# EAGLE design IOTKit_ch_open_V2 (EAGLE 6.5.0)

## Sheet 1 of 2
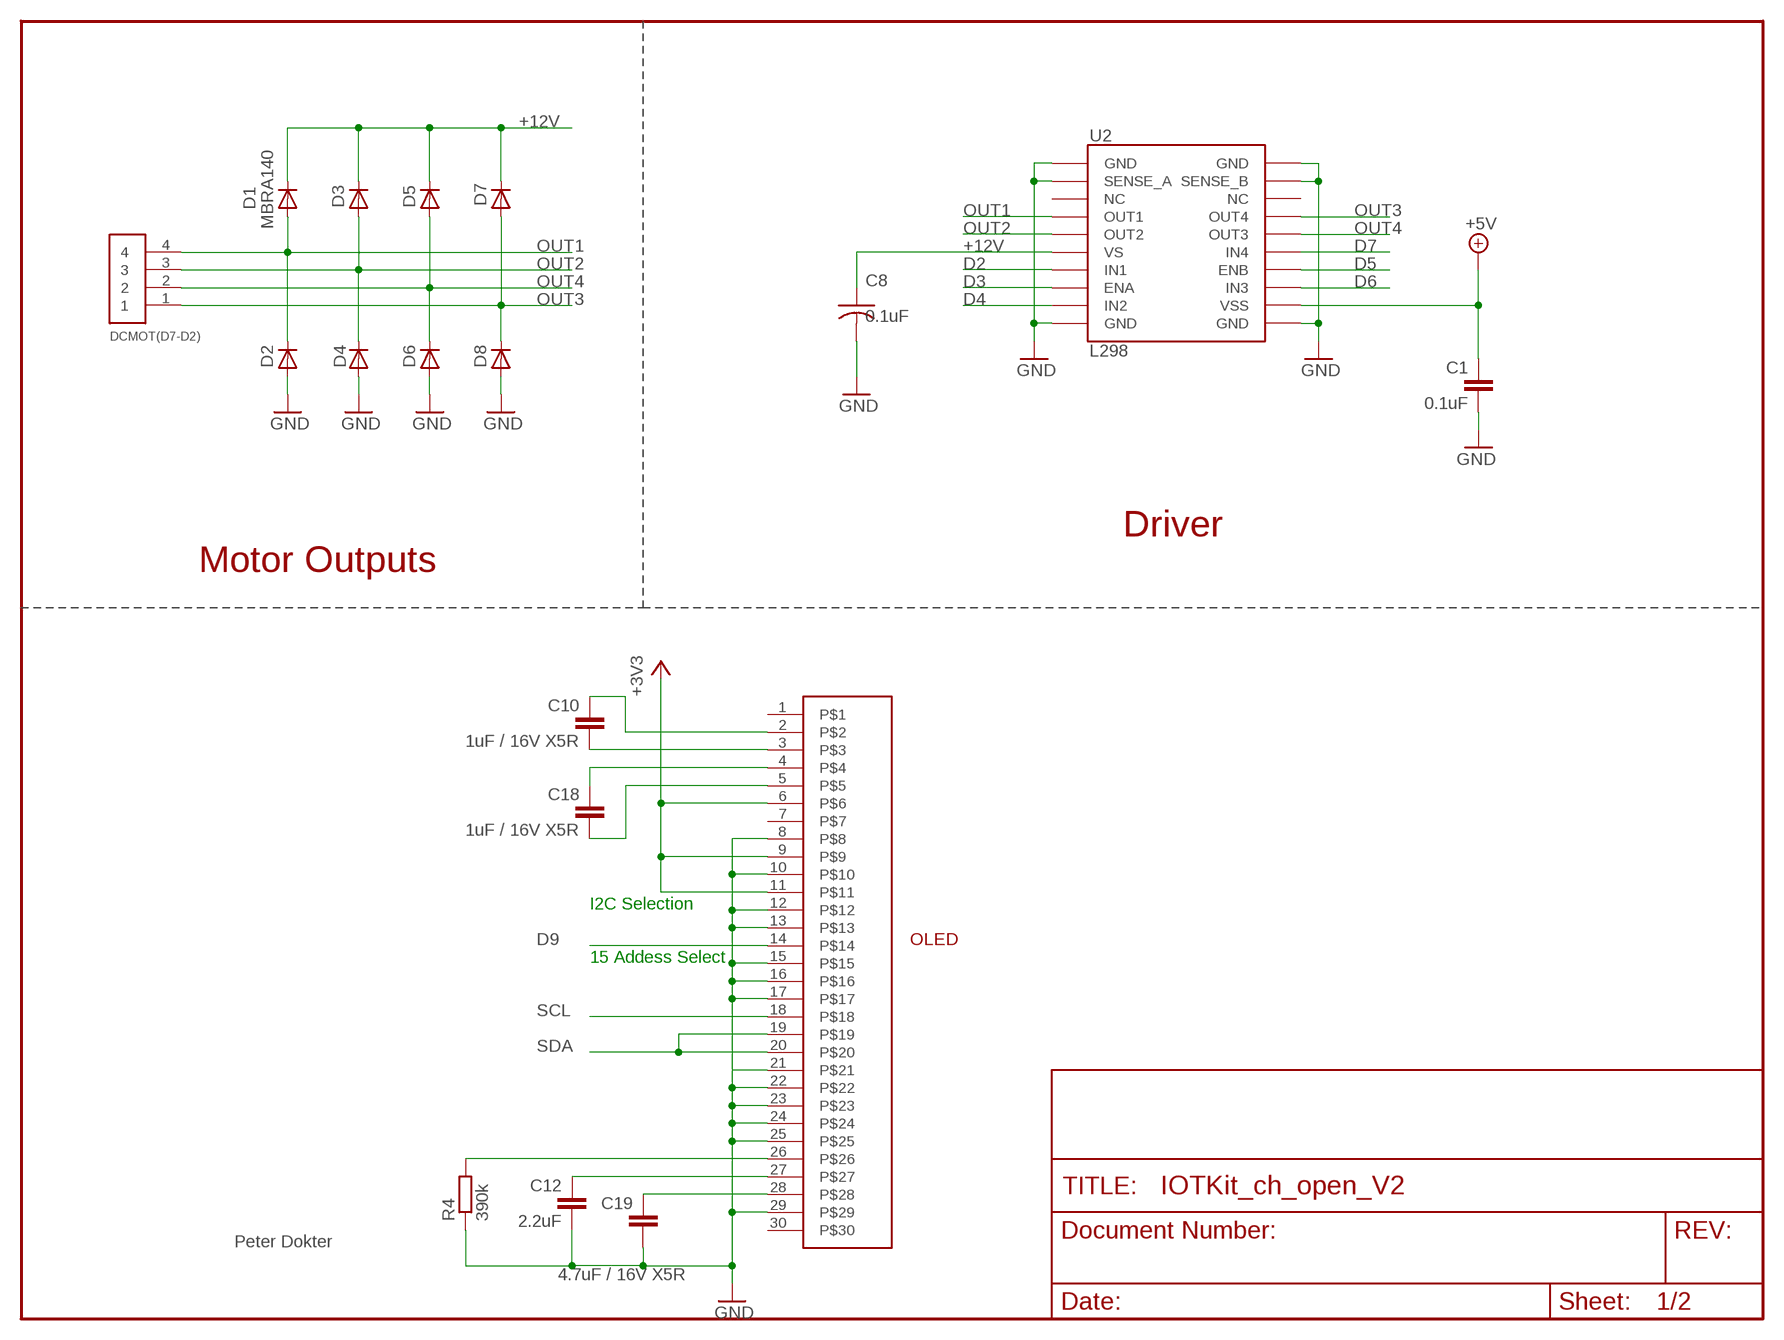
[diagram p0: schematic, sheet 1]

### Parts
C1  0.1uF  CAP0402-CAP  [0402-CAP]
C8  0.1uF  C-USC0603K  [C0603K]
C10  1uF / 16V X5R  CAP0603-CAP  [0603-CAP]
C12  2.2uF  CAP0603-CAP  [0603-CAP]
C18  1uF / 16V X5R  CAP0603-CAP  [0603-CAP]
C19  4.7uF / 16V X5R  CAP0603-CAP  [0603-CAP]
D1  MBRA140  DIODESMA  [SMA-DIODE]
D2  MBRA140  DIODESMA  [SMA-DIODE]
D3  MBRA140  DIODESMA  [SMA-DIODE]
D4  MBRA140  DIODESMA  [SMA-DIODE]
D5  MBRA140  DIODESMA  [SMA-DIODE]
D6  MBRA140  DIODESMA  [SMA-DIODE]
D7  MBRA140  DIODESMA  [SMA-DIODE]
D8  MBRA140  DIODESMA  [SMA-DIODE]
DCMOT(D7-D2)  1X4  [1X04_LINE]
R4  390k  R-EU_R0603  [R0603]
U2  L298  L298_BRIDGE_DRIVER  [POWERSO20]
U$4  OLED_096_1  [OLED_096_1]

### Nets
+3V3: U$4.6 U$4.9 U$4.11 ; also sheet 2
+5V: C1.1 U2.P$12(VSS) ; also sheet 2
+12V: C8.1 D1.C D3.C D5.C D7.C U2.P$6(VS) ; also sheet 2
D2: U2.P$7(IN1) ; also sheet 2
D3: U2.P$8(ENA) ; also sheet 2
D4: U2.P$9(IN2) ; also sheet 2
D5: U2.P$14(ENB) ; also sheet 2
D6: U2.P$13(IN3) ; also sheet 2
D7: U2.P$15(IN4) ; also sheet 2
D9: U$4.14 ; also sheet 2
GND: C1.2 C8.2 C12.2 C19.2 D2.A D4.A D6.A D8.A R4.1 U2.P$1(GND) U2.P$2(SENSE_A) U2.P$10(GND) U2.P$11(GND) U2.P$19(SENSE_B) U2.P$20(GND) U$4.8 U$4.10 U$4.12 U$4.13 U$4.15 U$4.16 U$4.17 U$4.21 U$4.22 U$4.23 U$4.24 U$4.25 U$4.29 ; also sheet 2
N$2: C18.2 U$4.5
N$15: R4.2 U$4.26
N$19: C19.1 U$4.28
N$30: C12.1 U$4.27
N$32: C18.1 U$4.4
N$47: C10.2 U$4.3
N$48: C10.1 U$4.2
OUT1: D1.A D2.C DCMOT(D7-D2).4 U2.P$4(OUT1)
OUT2: D3.A D4.C DCMOT(D7-D2).3 U2.P$5(OUT2)
OUT3: D7.A D8.C DCMOT(D7-D2).1 U2.P$17(OUT4)
OUT4: D5.A D6.C DCMOT(D7-D2).2 U2.P$16(OUT3)
SCL: U$4.18 ; also sheet 2
SDA: U$4.19 U$4.20 ; also sheet 2
Unconnected: U2.P$3(NC) U2.P$18(NC) U$4.1 U$4.7 U$4.30

### Notes on the sheet
- Driver
- Motor Outputs
- I2C Selection
- 15 Addess Select
- Peter Dokter

## Sheet 2 of 2
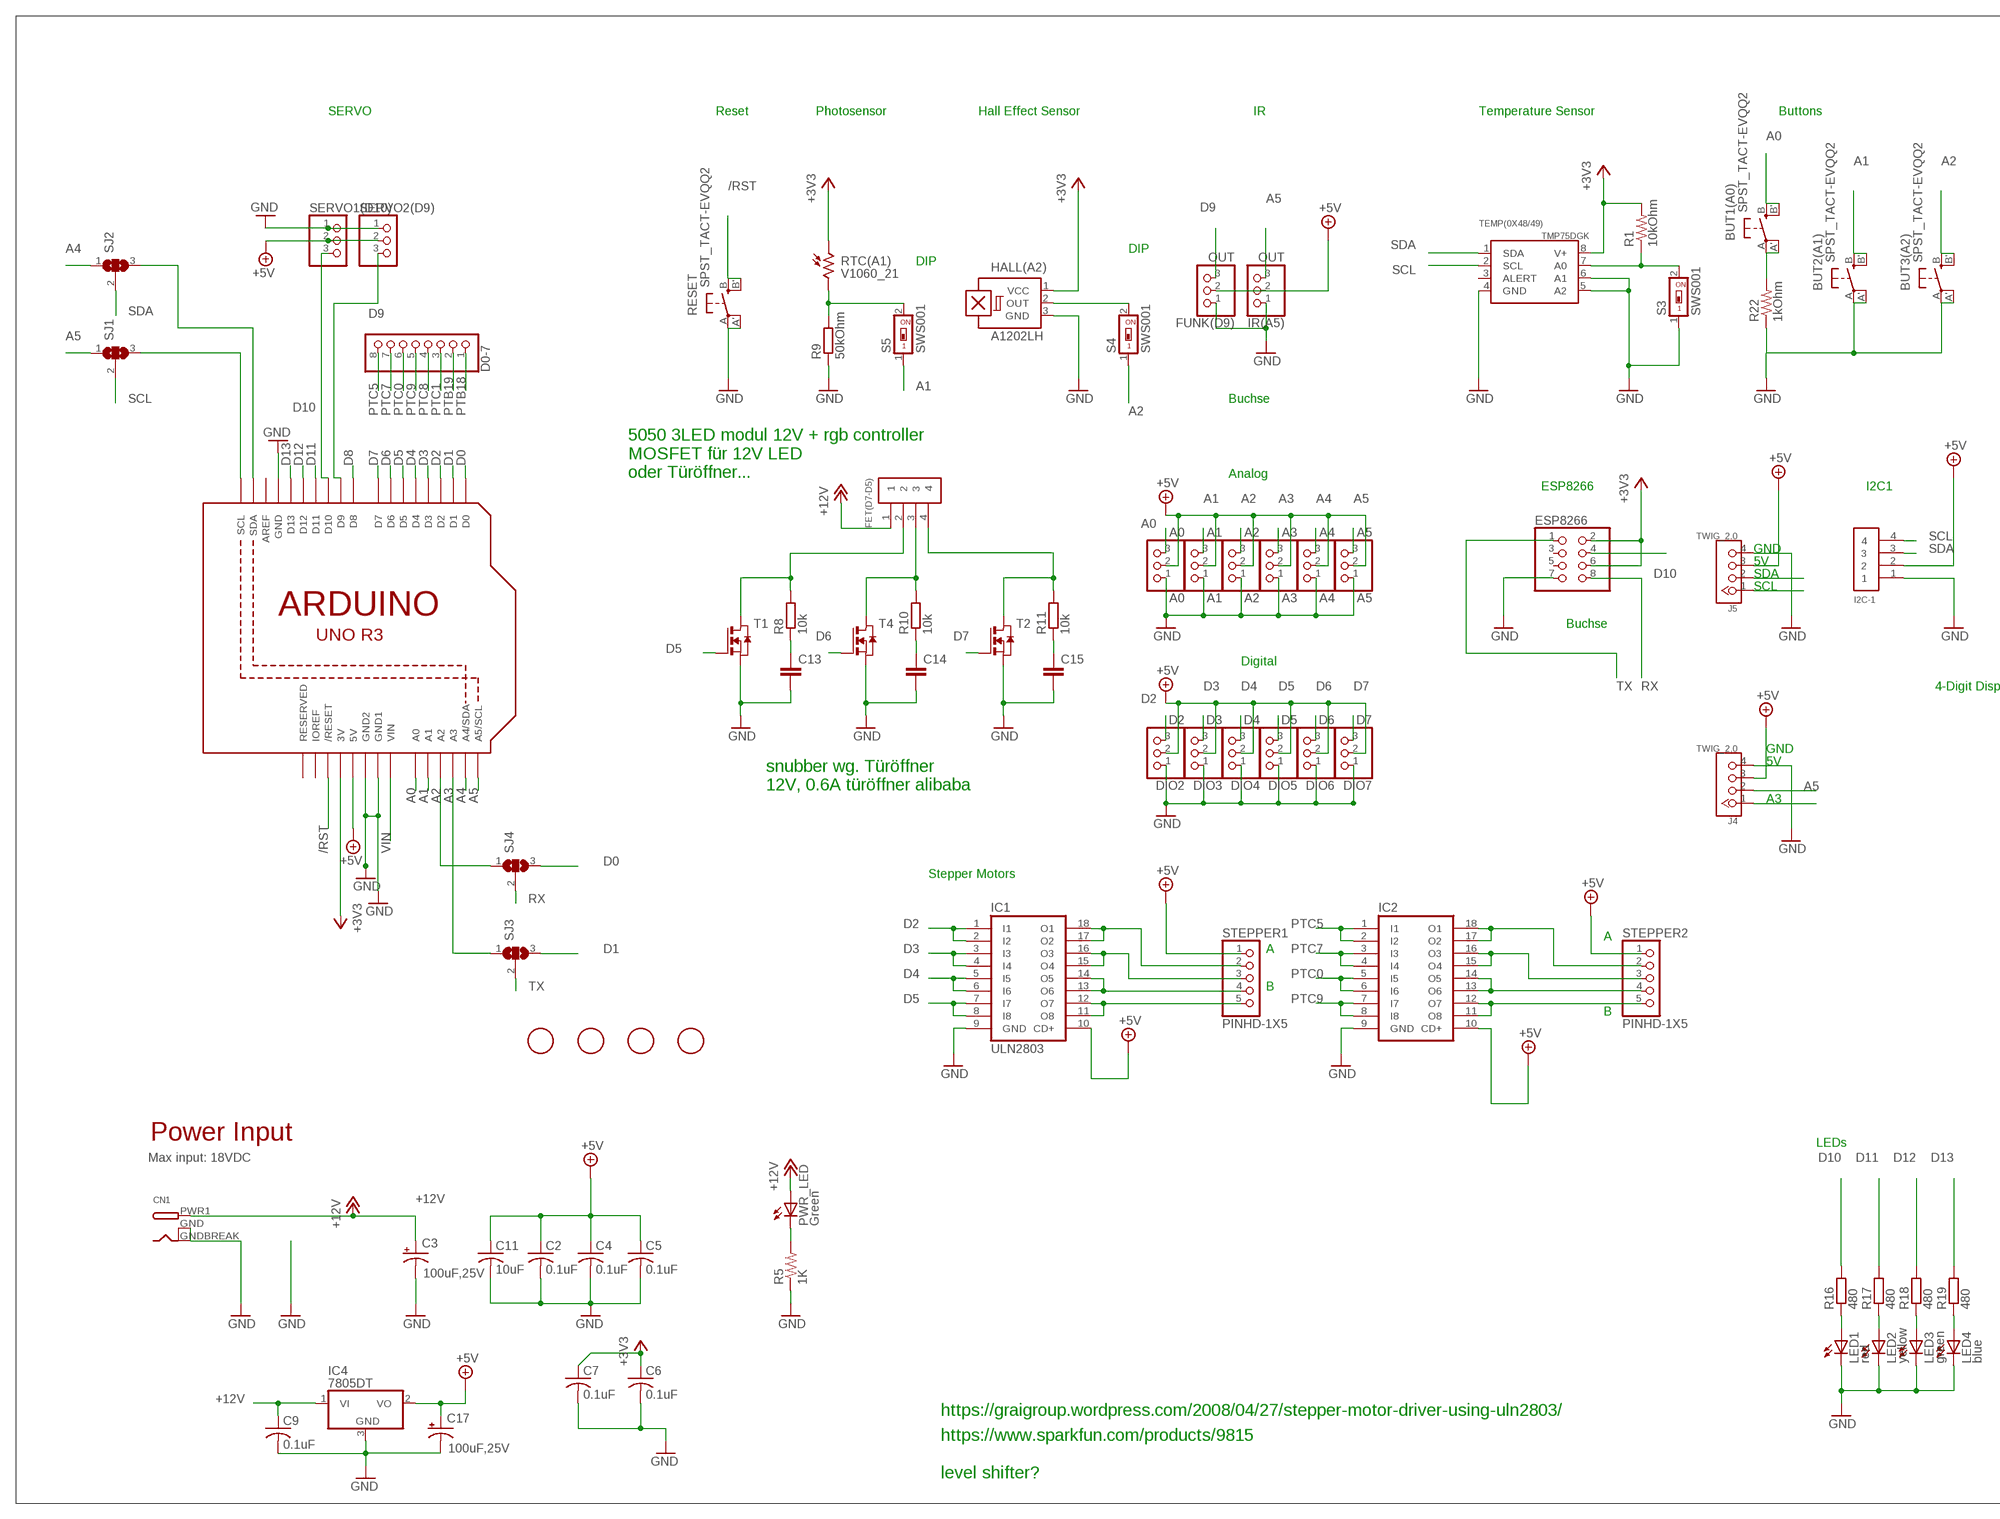
[diagram p1: schematic, sheet 2, part 1 of 2]
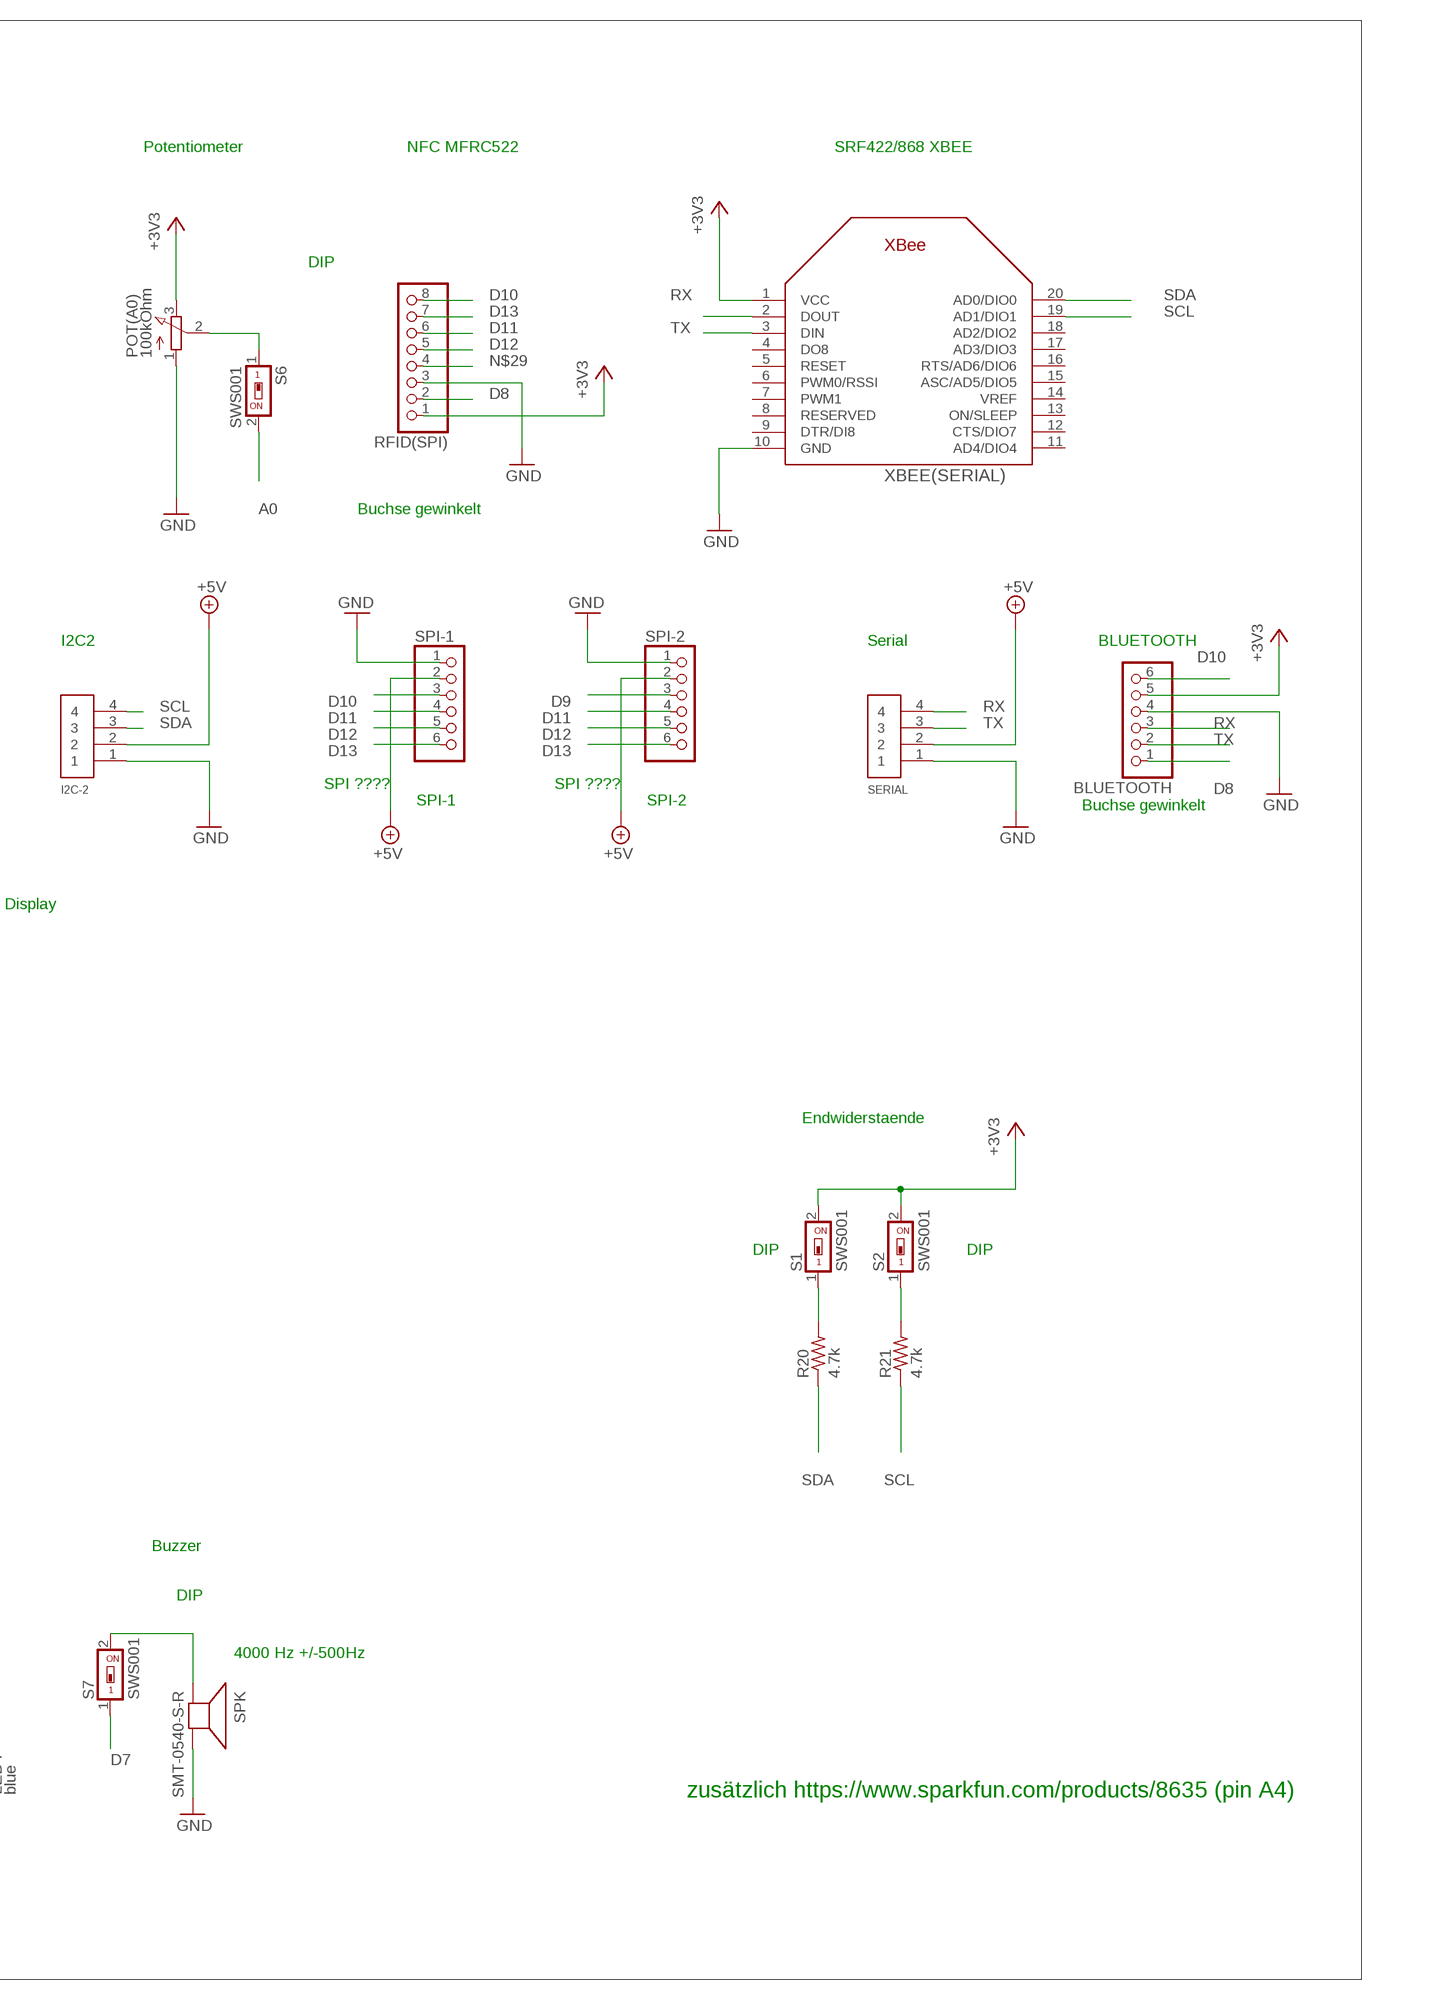
[diagram p2: schematic, sheet 2, part 2 of 2]

### Parts
A0  A0  PINHD-1X3  [1X03_LINE]
A1  A1  PINHD-1X3  [1X03_LINE]
A2  A2  PINHD-1X3  [1X03_LINE]
A3  A3  PINHD-1X3  [1X03_LINE]
A4  A4  PINHD-1X3  [1X03_LINE]
A5  A5  PINHD-1X3  [1X03_LINE]
BLUETOOTH  PINHD-1X6B  [1X06-BIG]
BUT1(A0)  SPST_TACT-EVQQ2  [EVQ-Q2]
BUT2(A1)  SPST_TACT-EVQQ2  [EVQ-Q2]
BUT3(A2)  SPST_TACT-EVQQ2  [EVQ-Q2]
C2  0.1uF  C-USC0603K  [C0603K]
C3  100uF,25V  CAP_POLF80  [NIPPON_F80]
C4  0.1uF  C-USC0603K  [C0603K]
C5  0.1uF  C-USC0603K  [C0603K]
C6  0.1uF  C-USC0603K  [C0603K]
C7  0.1uF  C-USC0603K  [C0603K]
C9  0.1uF  C-USC0805K  [C0805K]
C11  10uF  C-USC0805K  [C0805K]
C13  C-EUC0603  [C0603]
C14  C-EUC0603  [C0603]
C15  C-EUC0603  [C0603]
C17  100uF,25V  CAP_POLF80  [NIPPON_F80]
CN1  DCBARRELSMT  [DCJACK_2MM_SMT]
D0-7  PINHD-1X8CLEANBIG  [1X08-CLEANBIG]
DIO2  D2  PINHD-1X3  [1X03_LINE]
DIO3  D3  PINHD-1X3  [1X03_LINE]
DIO4  D4  PINHD-1X3  [1X03_LINE]
DIO5  D5  PINHD-1X3  [1X03_LINE]
DIO6  D6  PINHD-1X3  [1X03_LINE]
DIO7  D7  PINHD-1X3  [1X03_LINE]
ESP8266  PINHD-2X4  [2X04]
FET(D7-D5)  1X4  [1X04_LINE]
FUNK(D9)  OUT  PINHD-1X3  [1X03_LINE]
HALL(A2)  A1202LH  [SOT23-W]
I2C-1  1X4  [1X04_LINE]
I2C-2  1X4  [1X04_LINE]
IC1  ULN2803  ULN2803ASO18W  [SO18W]
IC2  ULN2803ASO18W  [SO18W]
IC4  7805DT  [TO252]
IR(A5)  OUT  PINHD-1X3  [1X03_LINE]
J4  TWIG_2.0  [2.0_1X4]
J5  TWIG_2.0  [2.0_1X4]
LED1  red  LEDCHIP-LED0603  [CHIP-LED0603]
LED2  yellow  LEDCHIP-LED0603  [CHIP-LED0603]
LED3  green  LEDCHIP-LED0603  [CHIP-LED0603]
LED4  blue  LEDCHIP-LED0603  [CHIP-LED0603]
POT(A0)  100kOhm  EVUF3A  [EVUF]
PWR_LED  Green  LEDCHIP-LED0805  [CHIP-LED0805]
R1  10kOhm  R-US_R0805  [R0805]
R5  1K  R-US_R0805  [R0805]
R8  10k  R-EU_R0805  [R0805]
R9  50kOhm  R-EU_R0603  [R0603]
R10  10k  R-EU_R0805  [R0805]
R11  10k  R-EU_R0805  [R0805]
R16  480  R-EU_R0603  [R0603]
R17  480  R-EU_R0603  [R0603]
R18  480  R-EU_R0603  [R0603]
R19  480  R-EU_R0603  [R0603]
R20  4.7k  R-US_R0805  [R0805]
R21  4.7k  R-US_R0805  [R0805]
R22  1kOhm  R-US_R0805  [R0805]
RESET  SPST_TACT-EVQQ2  [EVQ-Q2]
RFID(SPI)  PINHD-1X8BIG  [1X08-BIG]
RTC(A1)  V1060_21  [TO-5_V10]
S1  SWS001  [SMS-001]
S2  SWS001  [SMS-001]
S3  SWS001  [SMS-001]
S4  SWS001  [SMS-001]
S5  SWS001  [SMS-001]
S6  SWS001  [SMS-001]
S7  SWS001  [SMS-001]
SERIAL  1X4  [1X04_LINE]
SERVO1(D10)  PINHD-1X3  [1X03]
SERVO2(D9)  PINHD-1X3  [1X03]
SJ1  SJ2W  [SJ_2]
SJ2  SJ2W  [SJ_2]
SJ3  SJ2W  [SJ_2]
SJ4  SJ2W  [SJ_2]
SPI-1  PINHD-1X6B  [1X06-BIG]
SPI-2  PINHD-1X6B  [1X06-BIG]
SPK  SMT-0540-S-R  [SMT-0540-S-R]
STEPPER1  PINHD-1X5  [1X05]
STEPPER2  PINHD-1X5  [1X05]
T1  NMOSSOT223  [SOT223]
T2  NMOSSOT223  [SOT223]
T4  NMOSSOT223  [SOT223]
TEMP(0X48/49)  TMP75DGK  [MSOP8]
U$1  FIDUCIAL  [FIDUCIAL_1MM]
U$2  FIDUCIAL  [FIDUCIAL_1MM]
U$3  FIDUCIAL  [FIDUCIAL_1MM]
U$5  ARDUINOR3NONAME  [ARDUINOR2_ICSP_NODIM_NONAME]
U$6  FIDUCIAL  [FIDUCIAL_1MM]
XBEE(SERIAL)  XBEE  [XBEE]

### Nets
+3V3: BLUETOOTH.5 C6.1 C7.1 ESP8266.2 ESP8266.6 HALL(A2).1(VCC) POT(A0).3(E) R1.2 RFID(SPI).1 RTC(A1).1 S1.2 S2.2 TEMP(0X48/49).8(V+) U$5.3V XBEE(SERIAL).1(VCC) ; also sheet 1
+5V: A0.2 A1.2 A2.2 A3.2 A4.2 A5.2 C2.1 C4.1 C5.1 C11.1 C17.+ DIO2.2 DIO3.2 DIO4.2 DIO5.2 DIO6.2 DIO7.2 FUNK(D9).2 I2C-1.2 I2C-2.2 IC1.10(CD+) IC2.10(CD+) IC4.2(VO) IR(A5).2 J4.3 J5.3 SERIAL.2 SERVO1(D10).2 SERVO2(D9).2 SPI-1.2 SPI-2.2 STEPPER1.1 STEPPER2.1 U$5.5V ; also sheet 1
+12V: C3.+ C9.1 CN1.PWR1(PWR) FET(D7-D5).1 IC4.1(VI) PWR_LED.A ; also sheet 1
/RST: RESET.B'(S1) RESET.B(S) U$5.RESET(/RESET)
A0: A0.3 BUT1(A0).B'(S1) BUT1(A0).B(S) S6.2 U$5.A0
A1: A1.3 BUT2(A1).B'(S1) BUT2(A1).B(S) S5.1 U$5.A1
A2: A2.3 BUT3(A2).B'(S1) BUT3(A2).B(S) S4.1 SJ4.1 U$5.A2
A3: A3.3 J4.1 SJ3.1 U$5.A3
A4: A4.3 SJ2.1 U$5.A4(A4/SDA)
A5: A5.3 IR(A5).3 J4.2 SJ1.1 U$5.A5(A5/SCL)
D0: SJ4.3 U$5.D0
D1: SJ3.3 U$5.D1
D2: DIO2.3 IC1.1(I1) IC1.2(I2) U$5.D2 ; also sheet 1
D3: DIO3.3 IC1.3(I3) IC1.4(I4) U$5.D3 ; also sheet 1
D4: DIO4.3 IC1.5(I5) IC1.6(I6) U$5.D4 ; also sheet 1
D5: DIO5.3 IC1.7(I7) IC1.8(I8) T1.1(G) U$5.D5 ; also sheet 1
D6: DIO6.3 T4.1(G) U$5.D6 ; also sheet 1
D7: DIO7.3 S7.1 T2.1(G) U$5.D7 ; also sheet 1
D8: BLUETOOTH.1 RFID(SPI).2 U$5.D8
D9: FUNK(D9).3 SERVO2(D9).3 SPI-2.3 U$5.D9 ; also sheet 1
D10: BLUETOOTH.6 ESP8266.4 R16.2 RFID(SPI).8 SERVO1(D10).3 SPI-1.3 U$5.D10
D11: R17.2 RFID(SPI).6 SPI-1.4 SPI-2.4 U$5.D11
D12: R18.2 RFID(SPI).5 SPI-1.5 SPI-2.5 U$5.D12
D13: R19.2 RFID(SPI).7 SPI-1.6 SPI-2.6 U$5.D13
GND: A0.1 A1.1 A2.1 A3.1 A4.1 A5.1 BLUETOOTH.4 BUT2(A1).A'(P1) BUT2(A1).A(P) BUT3(A2).A'(P1) BUT3(A2).A(P) C2.2 C3.- C4.2 C5.2 C6.2 C7.2 C9.2 C11.2 C13.2 C14.2 C15.2 C17.- CN1.GND(GNDBREAK) CN1.GNDBREAK(GND) DIO2.1 DIO3.1 DIO4.1 DIO5.1 DIO6.1 DIO7.1 ESP8266.7 FUNK(D9).1 HALL(A2).3(GND) I2C-1.1 I2C-2.1 IC1.9(GND) IC2.9(GND) IC4.3(GND) IR(A5).1 J4.4 J5.4 LED1.C LED2.C LED3.C LED4.C POT(A0).1(A) R5.1 R9.1 R22.1 RESET.A'(P1) RESET.A(P) RFID(SPI).3 S3.1 SERIAL.1 SERVO1(D10).1 SERVO2(D9).1 SPI-1.1 SPI-2.1 SPK.+(-) T1.3(S) T2.3(S) T4.3(S) TEMP(0X48/49).4(GND) TEMP(0X48/49).5(A2) TEMP(0X48/49).6(A1) U$5.GND U$5.GND@1(GND1) U$5.GND@2(GND2) XBEE(SERIAL).10(GND) ; also sheet 1
N$1: R20.2 S1.1
N$3: R9.2 RTC(A1).2 S5.2
N$4: HALL(A2).2(OUT) S4.2
N$5: R21.2 S2.1
N$7: POT(A0).2(S) S6.1
N$8: S7.2 SPK.-(+)
N$9: R1.1 S3.2 TEMP(0X48/49).7(A0)
N$10: SJ1.3 U$5.SCL
N$11: SJ2.3 U$5.SDA
N$20: LED1.A R16.1
N$21: LED2.A R17.1
N$22: LED3.A R18.1
N$23: LED4.A R19.1
N$24: IC2.11(O8) IC2.12(O7) STEPPER2.5
N$25: IC2.13(O6) IC2.14(O5) STEPPER2.4
N$26: IC2.15(O4) IC2.16(O3) STEPPER2.3
N$27: IC2.17(O2) IC2.18(O1) STEPPER2.2
N$29: RFID(SPI).4
N$31: BUT1(A0).A'(P1) BUT1(A0).A(P) R22.2
N$34: C13.1 R8.1
N$35: FET(D7-D5).2 R8.2 T1.2(D) T1.4(D)
N$36: C14.1 R10.1
N$37: FET(D7-D5).3 R10.2 T4.2(D) T4.4(D)
N$38: C15.1 R11.1
N$39: FET(D7-D5).4 R11.2 T2.2(D) T2.4(D)
N$41: IC1.11(O8) IC1.12(O7) STEPPER1.5
N$42: IC1.13(O6) IC1.14(O5) STEPPER1.4
N$43: IC1.15(O4) IC1.16(O3) STEPPER1.3
N$44: IC1.17(O2) IC1.18(O1) STEPPER1.2
PTB18: D0-7.1
PTB19: D0-7.2
PTC0: D0-7.6 IC2.5(I5) IC2.6(I6)
PTC1: D0-7.3
PTC5: D0-7.8 IC2.1(I1) IC2.2(I2)
PTC7: D0-7.7 IC2.3(I3) IC2.4(I4)
PTC8: D0-7.4
PTC9: D0-7.5 IC2.7(I7) IC2.8(I8)
PWR_LED: PWR_LED.C R5.2
RX: BLUETOOTH.3 ESP8266.8 SERIAL.4 SJ4.2 XBEE(SERIAL).2(DOUT)
SCL: I2C-1.4 I2C-2.4 J5.1 R21.1 SJ1.2 TEMP(0X48/49).2(SCL) XBEE(SERIAL).19(AD1/DIO1) ; also sheet 1
SDA: I2C-1.3 I2C-2.3 J5.2 R20.1 SJ2.2 TEMP(0X48/49).1(SDA) XBEE(SERIAL).20(AD0/DIO0) ; also sheet 1
TX: BLUETOOTH.2 ESP8266.1 SERIAL.3 SJ3.2 XBEE(SERIAL).3(DIN)
VIN: U$5.VIN
Unconnected: ESP8266.3 ESP8266.5 TEMP(0X48/49).3(ALERT) U$5.AREF U$5.IOREF U$5.RESERVED XBEE(SERIAL).4(DO8) XBEE(SERIAL).5(RESET) XBEE(SERIAL).6(PWM0/RSSI) XBEE(SERIAL).7(PWM1) XBEE(SERIAL).8(RESERVED) XBEE(SERIAL).9(DTR/DI8) XBEE(SERIAL).11(AD4/DIO4) XBEE(SERIAL).12(CTS/DIO7) XBEE(SERIAL).13(ON/SLEEP) XBEE(SERIAL).14(VREF) XBEE(SERIAL).15(ASC/AD5/DIO5) XBEE(SERIAL).16(RTS/AD6/DIO6) XBEE(SERIAL).17(AD3/DIO3) XBEE(SERIAL).18(AD2/DIO2)

### Notes on the sheet
- SERVO | Reset | Photosensor | Hall Effect Sensor | IR | Temperature Sensor | Buttons | Potentiometer | NFC MFRC522 | SRF422/868 XBEE
- DIP
- DIP
- DIP
- Buchse gewinkelt
- Buchse
- 5050 3LED modul 12V + rgb controller
- MOSFET für 12V LED
  oder Türöffner...
- Analog
- ESP8266 | I2C1 | I2C2 | Serial | BLUETOOTH
- GND
- 5V
- SDA
- SCL | SPI ???? | SPI ????
- SPI-1 | SPI-2
- Buchse gewinkelt
- Buchse
- Digital
- 4-Digit Display
- GND
- 5V
- snubber wg. Türöffner
  12V, 0.6A türöffner alibaba
- A3
- Endwiderstaende
- Stepper Motors
- A
- A | DIP | DIP
- B
- B
- Power Input
- LEDs
- Max input: 18VDC
- Buzzer
- DIP
- 4000 Hz +/-500Hz
- zusätzlich https://www.sparkfun.com/products/8635 (pin A4)
- https://graigroup.wordpress.com/2008/04/27/stepper-motor-driver-using-uln2803/
- https://www.sparkfun.com/products/9815
- level shifter?

## Library data of the parts
A0 A1-A5 DIO2-DIO7 FUNK(D9) IR(A5) = Gaudi:PINHD-1X3: PIN HEADER
BLUETOOTH SPI-1 SPI-2 = adafruit:PINHD-1X6: PIN HEADER
BUT1(A0) BUT2(A1) BUT3(A2) RESET = adafruit:SPST_TACT: SMT 6mm switch, EVQQ2 series http://www.ladyada.net/library/eagle
C1 C10 C12 C18 C19 = SparkFun:CAP: Capacitor Standard 0603 ceramic capacitor, and 0.1" leaded capacitor.
C2 C4-C9 C11 = adafruit:C-US: CAPACITOR, American symbol
C3 C17 = SparkFun:CAP_POL: Capacitor Polarized These are standard SMD and PTH capacitors. Normally 10uF, 47uF, and 100uF in electrolytic and tantalum varieties. Always verify the external diameter of the through hole cap, it varies with capacity, voltage, and manufacturer. The EIA devices should be standard.
C13-C15 = resistor:C-EU: CAPACITOR, European symbol
CN1 = adafruit:DCBARREL: 2.0mm DC Barrel Jack DCJACK_2MM_PTH - Through Hole Jack (4UConnector: 05537)
D0-7 RFID(SPI) = adafruit:PINHD-1X8: PIN HEADER
D1-D8 = SparkFun:DIODE: Diode These are standard reverse protection diodes and small signal diodes. SMA package can handle up to about 1A. SOD-323 can handle about 200mA. What the SOD-323 package when ordering, there are some mfgs out there that are 5-pin packages.
DCMOT(D7-D2) FET(D7-D5) I2C-1 I2C-2 SERIAL = Gaudi:1X4: 4-pin connector
ESP8266 = adafruit:PINHD-2X4: PIN HEADER
HALL(A2) = allegro:A12*?: Hall-effect bipolar switch Source: http://www.allegromicro.com/en/Products/Part_Numbers/1202/1202.pdf; OC_FARNELL: unknown; OC_NEWARK: unknown
IC1 IC2 = IOTKit:ULN2803A: DRIVER ARRAY
IC4 = adafruit:78*: Positive VOLTAGE REGULATOR Added bigger pads to the TO-92 package
J4 J5 = CONNECTER:TWIG_2.0
LED1-LED4 PWR_LED = adafruit:LED: LED OSRAM: - CHIPLED LG R971, LG N971, LY N971, LG Q971, LY Q971, LO R971, LY R971 LH N974, LH R974 LS Q976, LO Q976, LY Q976 LO Q996 - Hyper CHIPLED LW Q18S LB Q993, LB Q99A, LB R99A - SideLED LS A670, LO A670, LY A670, LG A670, LP A670 LB A673, LV A673, LT A673, LW A673 LH A674 LY A675 LS A676, LA A676, LO A676, LY A676, LW A676 LS A679, LY A679, LG A679 - Hyper Micro SIDELED® LS Y876, LA Y876, LO Y876, LY Y876 LT Y87S - SmartLED LW L88C, LW L88S LB L89C, LB L89S, LG L890 LS L89K, LO L89K, LY L89K LS L896, LA L896, LO L896, LY L896 - TOPLED LS T670, LO T670, LY T670, LG T670, LP T670 LSG T670, LSP T670, LSY T670, LOP T670, LYG T670 LG T671, LOG T671, LSG T671 LB T673, LV T673, LT T673, LW T673 LH T674 LS T676, LA T676, LO T676, LY T676, LB T676, LH T676, LSB T676, LW T676 LB T67C, LV T67C, LT T67C, LS T67K, LO T67K, LY T67K, LW E67C LS E67B, LA E67B, LO E67B, LY E67B, LB E67C, LV E67C, LT E67C LW T67C LS T679, LY T679, LG T679 LS T770, LO T770, LY T770, LG T770, LP T770 LB T773, LV T773, LT T773, LW T773 LH T774 LS E675, LA E675, LY E675, LS T675 LS T776, LA T776, LO T776, LY T776, LB T776 LHGB T686 LT T68C, LB T68C - Hyper Mini TOPLED® LB M676 - Mini TOPLED Santana® LG M470 LS M47K, LO M47K, LY M47K Source: http://www.osram.convergy.de/
POT(A0) = Gaudi:EVU: 9 mm Square Rotary Potentiometers Source: Panasonic
R1 R5 R20-R22 = adafruit:R-US_: RESISTOR, American symbol
R4 R8-R11 R16-R19 = rcl:R-EU_: RESISTOR, European symbol
RTC(A1) = photo-elements:?1060*: Sensor Street Light control Source: http://optoelectronics.perkinelmer.com/content/Datasheets/DTS_PhotocellsB1060.pdf
S1-S7 = smd-special:SWS001: SMD Dip Switch 1 pol.
SERVO1(D10) SERVO2(D9) = adafruit:PINHD-1X3: PIN HEADER
SJ1-SJ4 = jumper:SJ2W: SMD solder JUMPER
SPK = adafruit:SMT-0540-S-R: SMT-0549-S-R Small surface-mount magnetic buzzer
STEPPER1 STEPPER2 = Gaudi:PINHD-1X5
T1 T2 T4 = zetex:NMOSSOT223: MOS FET; OC_FARNELL: unknown; OC_NEWARK: unknown
TEMP(0X48/49) = ti_tmp:TMP75
U2 = SparkFun:L298_BRIDGE_DRIVER
U$1-U$3 U$6 = adafruit:FIDUCIAL: For use by pick and place machines to calibrate the vision/machine, 1mm By microbuilder.eu
U$4 = Gaudi:OLED_096_1
U$5 = adafruit:ARDUINOR3: This is a new object for the new Arduino R3 - with extra pins that you may want to use (such as IOref, and duplicated A4/A5
XBEE(SERIAL) = adafruit:XBEE

## Net classes
1 power: width 0.61 mm

## Board
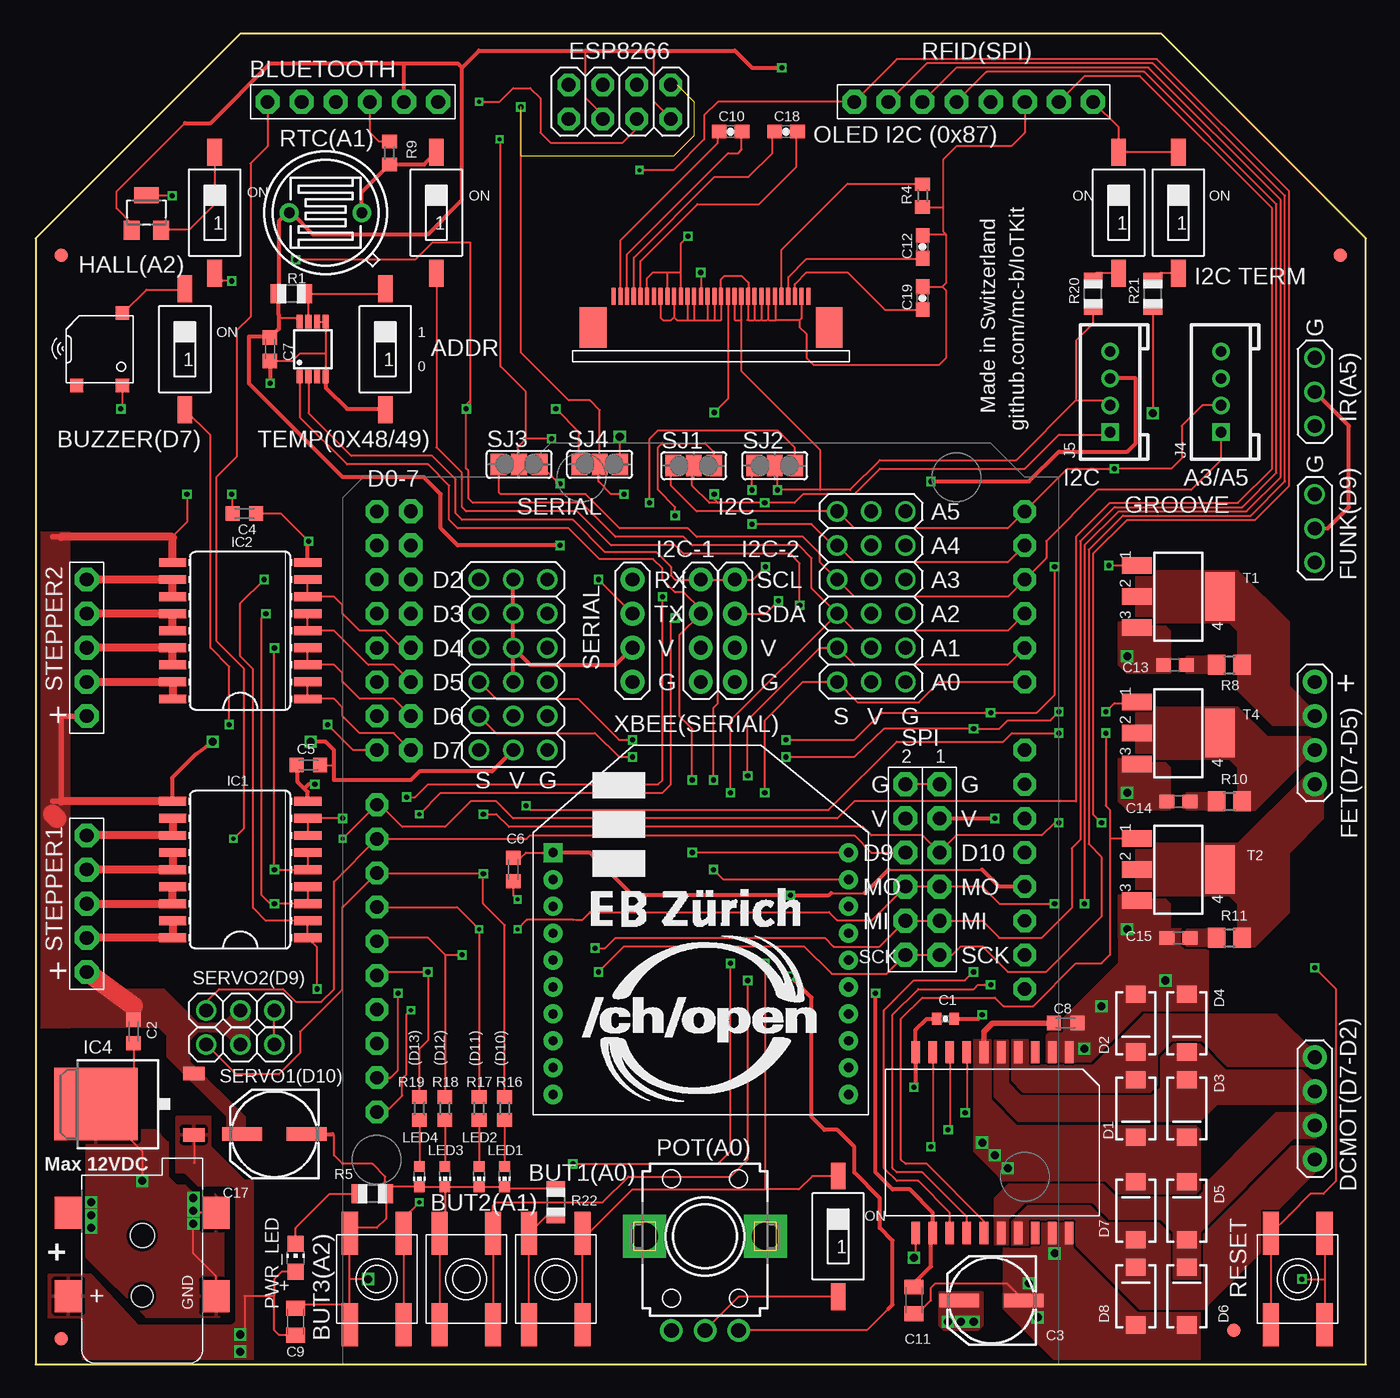
[diagram p3: board, top side]
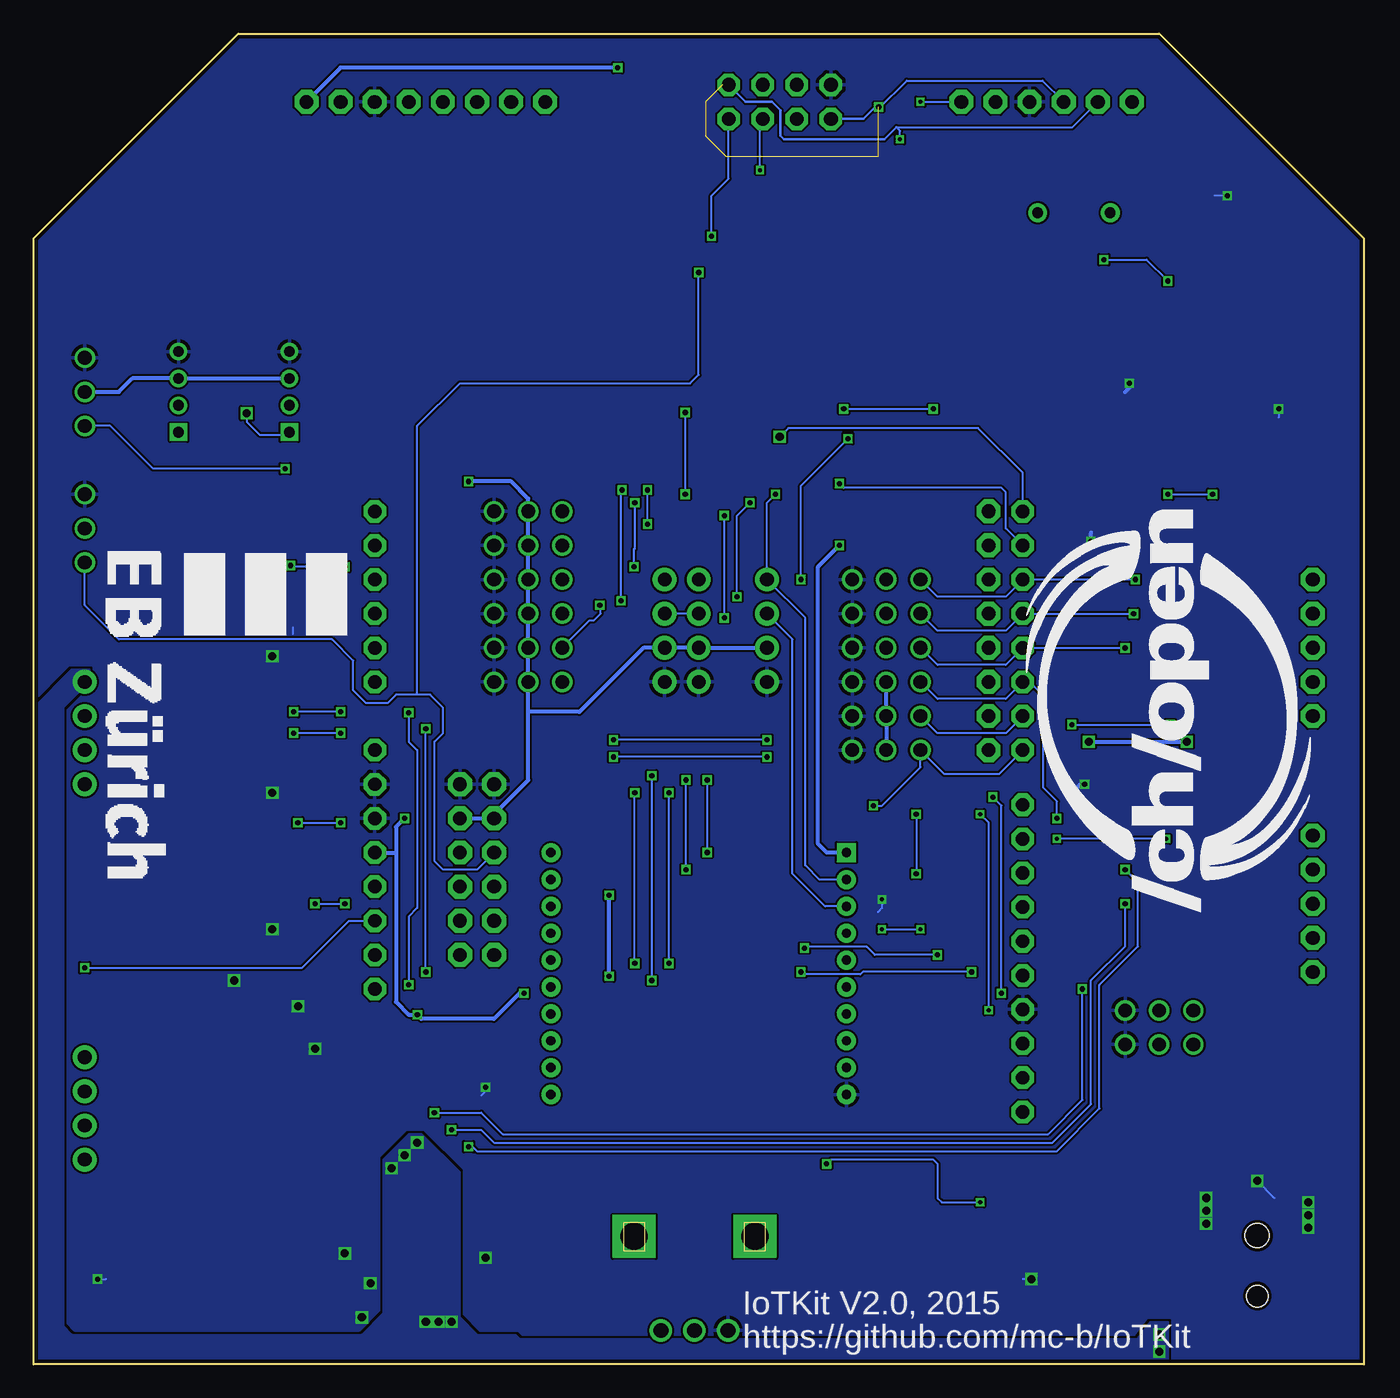
[diagram p4: board, bottom side, seen from below]

Size 99.06 x 99.06 mm. Coordinates in mm from the lower left corner, seen from the top.
Outline: 0,0 99.06,0 99.06,83.82 83.82,99.06 15.24,99.06 0,83.82 0,0
Copper layers (1*16): Top 0.035mm / dielectric 1.5mm / Bottom 0.035mm
Design rules "SeeedStudio_2layer_DRU_no_angle_20140221": minimum track width 6mil, minimum drill 12mil, track to track 6mil, track to pad 6mil, pad to pad 6mil, via to via 6mil, smd to smd 0mil, copper to edge 10mil, drill to drill 10mil, minimum pad ring 10mil, minimum via ring 6mil, stop-mask expansion 2mil, vias tented up to drill 100mil, thermal gap 10mil

### Footprints (pad centres in the part's own frame; a part is rotated, then mirrored left to right if it is on the bottom)
1X03_LINE = drill 1.016: 1 -2.54,0; 2 0,0; 3 2.54,0
1X06-BIG = drill 1.016 pad 1.778 octagon: 1 -6.35,0; 2 -3.81,0; 3 -1.27,0; 4 1.27,0; 5 3.81,0; 6 6.35,0
EVQ-Q2 = smd 3.2 x 1.2: A -3.4,-2; A' 3.4,-2; B -3.4,2; B' 3.4,2
0402-CAP = smd 0.7 x 0.9: 1 -0.65,0; 2 0.65,0
C0603K = smd 1.05 x 1.08: 1 -0.875,0; 2 0.875,0
NIPPON_F80 = smd 2.95 x 1: + 2.4,0; - -2.4,0
C0805K = smd 1.1 x 1.4: 1 -1,0; 2 1,0
0603-CAP = smd 1.1 x 1: 1 -0.85,0; 2 0.85,0
C0603 = smd 1.1 x 1: 1 -0.85,0; 2 0.85,0
DCJACK_2MM_SMT = smd 2.4 x 2: GND 0,-5.5; GNDBREAK 6.2,-5.5; PWR1 0,5.5; PWR2 6.2,5.5 | hole 1.6: 0,0 | hole 1.8: 4.5,0
1X08-CLEANBIG = drill 1.016 pad 1.778 octagon: 1 -8.89,0; 2 -6.35,0; 3 -3.81,0; 4 -1.27,0; 5 1.27,0; 6 3.81,0; 7 6.35,0; 8 8.89,0
SMA-DIODE = smd 1.27 x 1.47: A -2.15,0; C 2.15,0
1X04_LINE = drill 1.016 pad 1.778: 1 -3.81,0; 2 -1.27,0; 3 1.27,0; 4 3.81,0
2X04 = drill 1.016 pad 1.676 octagon: 1 -3.81,-1.27; 2 -3.81,1.27; 3 -1.27,-1.27; 4 -1.27,1.27; 5 1.27,-1.27; 6 1.27,1.27; 7 3.81,-1.27; 8 3.81,1.27
SOT23-W = smd 1.2 x 1.4: 1 -1.1,-1.3; 2 1.1,-1.3 | smd 1.8 x 1.2: 3 0,1.3
SO18W = smd 0.66 x 2.032: 1 -5.08,-5.029; 2 -3.81,-5.029; 3 -2.54,-5.029; 4 -1.27,-5.029; 5 0,-5.029; 6 1.27,-5.029; 7 2.54,-5.029; 8 3.81,-5.029; 9 5.08,-5.029; 10 5.08,5.029; 11 3.81,5.029; 12 2.54,5.029; 13 1.27,5.029; 14 0,5.029; 15 -1.27,5.029; 16 -2.54,5.029; 17 -3.81,5.029; 18 -5.08,5.029
TO252 = smd 1 x 1.6: 1 -2.28,-4.8; 2 2.28,-4.8 | smd 5.4 x 6.2: 3 0,2.5
2.0_1X4 = drill 0.8 pad 1.27 square: 1 -3,0 | drill 0.8 pad 1.27: 2 -1,0; 3 1,0; 4 3,0
CHIP-LED0603 = smd 0.8 x 0.8: A 0,-0.75; C 0,0.75
EVUF = drill 1.1 pad 1.676: 1 -2.5,-7; 2 0,-7; 3 2.5,-7 | drill 2 pad 3.2 square: M1 4.5,0; M2 -4.5,0
CHIP-LED0805 = smd 1.2 x 1.2: A 0,-1.05; C 0,1.05
R0805 = smd 1.1 x 1.4: 1 -1,0; 2 1,0
R0603 = smd 1 x 1.1: 1 -0.85,0; 2 0.85,0
R0805' = smd 1.3 x 1.5: 1 -0.95,0; 2 0.95,0
1X08-BIG = drill 1.016 pad 1.778 octagon: 1 -8.89,0; 2 -6.35,0; 3 -3.81,0; 4 -1.27,0; 5 1.27,0; 6 3.81,0; 7 6.35,0; 8 8.89,0
TO-5_V10 = drill 0.8 pad 1.4: 1 -2.7,0; 2 2.7,0
SMS-001 = smd 1.092 x 2.007: 1 0,-4.496; 2 0,4.496
1X03 = drill 1.016: 1 -2.54,0; 2 0,0; 3 2.54,0
SJ_2 = smd 1.168 x 1.6: 1 -1.524,0; 2 0,0; 3 1.524,0
SMT-0540-S-R = smd 1 x 1: + 1.7,-2.7; - 1.7,2.7; M -1.7,-2.7
1X05 = drill 1.016 pad 1.778 octagon: 1 -5.08,0; 2 -2.54,0; 3 0,0; 4 2.54,0; 5 5.08,0
SOT223 = smd 1.219 x 2.235: 1 -2.311,-3.099; 2 0,-3.099; 3 2.311,-3.099 | smd 3.6 x 2.2: 4 0,3.099
MSOP8 = smd 0.45 x 1: 1 -0.975,-2.05; 2 -0.325,-2.05; 3 0.325,-2.05; 4 0.975,-2.05; 5 0.975,2.05; 6 0.325,2.05; 7 -0.325,2.05; 8 -0.975,2.05
POWERSO20 = smd 1.651 x 0.635: P$1 -6.731,5.715; P$2 -6.731,4.445; P$3 -6.731,3.175; P$4 -6.731,1.905; P$5 -6.731,0.635; P$6 -6.731,-0.635; P$7 -6.731,-1.905; P$8 -6.731,-3.175; P$9 -6.731,-4.445; P$10 -6.731,-5.715; P$11 6.731,-5.715; P$12 6.731,-4.445; P$13 6.731,-3.175; P$14 6.731,-1.905; P$15 6.731,-0.635; P$16 6.731,0.635; P$17 6.731,1.905; P$18 6.731,3.175; P$19 6.731,4.445; P$20 6.731,5.715
FIDUCIAL_1MM = smd 1 x 1: 1 0,0
OLED_096_1 = smd 0.3 x 1.25: 1 -7.25,0; 2 -6.75,0; 3 -6.25,0; 4 -5.75,0; 5 -5.25,0; 6 -4.75,0; 7 -4.25,0; 8 -3.75,0; 9 -3.25,0; 10 -2.75,0; 11 -2.25,0; 12 -1.75,0; 13 -1.25,0; 14 -0.75,0; 15 -0.25,0; 16 0.25,0; 17 0.75,0; 18 1.25,0; 19 1.75,0; 20 2.25,0; 21 2.75,0; 22 3.25,0; 23 3.75,0; 24 4.25,0; 25 4.75,0; 26 5.25,0; 27 5.75,0; 28 6.25,0; 29 6.75,0; 30 7.25,0 | smd 2 x 3: P$31 8.803,-2.325; P$32 -8.796,-2.325
ARDUINOR2_ICSP_NODIM_NONAME = drill 1 pad 1.676 octagon: 3V 35.56,2.54; 5V 38.1,2.54; A0 50.8,2.54; A1 53.34,2.54; A2 55.88,2.54; A3 58.42,2.54; A4 60.96,2.54; A5 63.5,2.54; AREF 23.876,50.8; D0 63.5,50.8; D1 60.96,50.8; D2 58.42,50.8; D3 55.88,50.8; D4 53.34,50.8; D5 50.8,50.8; D6 48.26,50.8; D7 45.72,50.8; D8 41.656,50.8; D9 39.116,50.8; D10 36.576,50.8; D11 34.036,50.8; D12 31.496,50.8; D13 28.956,50.8; GND 26.416,50.8; GND@1 43.18,2.54; GND@2 40.64,2.54; IOREF 30.48,2.54; RESERVED 27.94,2.54; RESET 33.02,2.54; SCL 18.796,50.8; SDA 21.336,50.8; VIN 45.72,2.54
XBEE = drill 0.7 pad 1.422 square: 1 -11,5.5 | drill 0.7 pad 1.422: 2 -11,3.5; 3 -11,1.5; 4 -11,-0.5; 5 -11,-2.5; 6 -11,-4.5; 7 -11,-6.5; 8 -11,-8.5; 9 -11,-10.5; 10 -11,-12.5; 11 11,-12.5; 12 11,-10.5; 13 11,-8.5; 14 11,-6.5; 15 11,-4.5; 16 11,-2.5; 17 11,-0.5; 18 11,1.5; 19 11,3.5; 20 11,5.5

### Placement (x,y rotation side)
A0  62.23,50.8 180 top
A1  62.23,53.34 180 top
A2  62.23,55.88 180 top
A3  62.23,58.42 180 top
A4  62.23,60.96 180 top
A5  62.23,63.5 180 top
BLUETOOTH  23.62,93.98 0 top
BUT1(A0)  38.73,6.35 270 top
BUT2(A1)  32.07,6.35 270 top
BUT3(A2)  25.4,6.35 270 top
C1  67.75,25.72 180 top
C2  7.3,24.77 270 top
C3  71.18,4.76 180 top
C4  15.56,63.34 0 top
C5  20.32,44.61 180 top
C6  35.56,36.83 270 top
C7  17.46,75.56 270 top
C8  76.71,25.4 0 top
C9  19.37,3.17 90 top
C10  51.75,91.76 0 top
C11  65.41,4.76 270 top
C12  66.04,83.19 90 top
C13  84.84,52.07 180 top
C14  85.09,41.91 180 top
C15  85.09,31.75 180 top
C17  17.78,17.14 180 top
C18  55.88,91.76 0 top
C19  66.04,79.38 90 top
CN1  7.94,5.08 90 top
D0-7  27.94,54.61 270 top
D1  81.92,19.05 270 top
D2  81.92,25.4 270 top
D3  85.72,19.05 270 top
D4  85.72,25.4 270 top
D5  85.72,11.43 90 top
D6  85.72,5.08 90 top
D7  81.92,11.43 90 top
D8  81.92,5.08 90 top
DCMOT(D7-D2)  95.25,19.05 90 top
DIO2  35.56,58.42 180 top
DIO3  35.56,55.88 180 top
DIO4  35.56,53.34 180 top
DIO5  35.56,50.8 180 top
DIO6  35.56,48.26 180 top
DIO7  35.56,45.72 180 top
ESP8266  43.5,93.98 180 top
FET(D7-D5)  95.25,46.99 270 top
FUNK(D9)  95.25,62.23 270 top
HALL(A2)  8.26,85.72 0 top
I2C-1  49.53,54.61 90 top
I2C-2  52.07,54.61 90 top
IC1  15.24,36.83 90 top
IC2  15.24,54.61 90 top
IC4  6.99,19.37 90 top
IR(A5)  95.25,72.39 270 top
J4  88.27,72.39 90 top
J5  80.01,72.39 90 top
LED1  34.92,13.97 180 top
LED2  33.02,13.97 180 top
LED3  30.48,13.97 180 top
LED4  28.57,13.97 180 top
POT(A0)  49.85,9.53 0 top
PWR_LED  19.37,7.94 0 top
R1  19.05,79.69 180 top
R4  66.04,87 90 top
R5  25.08,12.7 180 top
R8  10k  [R0805']  88.9,52.07 0 top
R9  26.35,90.17 270 top
R10  10k  [R0805']  88.9,41.91 0 top
R11  10k  [R0805']  88.9,31.75 0 top
R16  34.92,19.05 90 top
R17  33.02,19.05 90 top
R18  30.48,19.05 90 top
R19  28.57,19.05 90 top
R20  78.74,79.69 90 top
R21  83.19,79.69 90 top
R22  38.73,12.06 270 top
RESET  93.98,6.35 90 top
RFID(SPI)  69.85,93.98 180 top
RTC(A1)  21.59,85.72 0 top
S1  80.64,85.72 0 top
S2  85.09,85.72 0 top
S3  26.04,75.56 0 top
S4  13.34,85.72 0 top
S5  29.84,85.72 0 top
S6  59.75,9.53 0 top
S7  11.11,75.56 0 top
SERIAL  44.45,54.61 90 top
SERVO1(D10)  15.24,23.81 180 top
SERVO2(D9)  15.24,26.35 180 top
SJ1  49.01,66.9 0 top
SJ2  55.04,66.9 0 top
SJ3  36,67 0 top
SJ4  42,67 0 top
SPI-1  67.31,36.83 270 top
SPI-2  64.77,36.83 270 top
SPK  4.76,75.56 0 top
STEPPER1  3.81,34.29 90 top
STEPPER2  3.81,53.34 90 top
T1  85.09,57.15 270 top
T2  85.09,36.83 270 top
T4  85.09,46.99 270 top
TEMP(0X48/49)  20.64,75.56 0 top
U2  71.25,16.51 270 top
U$1  89.22,2.54 0 top
U$2  97.16,82.55 0 top
U$3  1.91,82.55 0 top
U$4  50.29,79.5 0 top
U$5  76.2,0 90 top
U$6  1.91,1.91 0 top
XBEE(SERIAL)  49.53,32.59 0 top

### Tracks (layer width: path | path; a pad name or v marks a point on that pad's centre or on a via)
+3V3  (via drill 0.38)
  Top 0.152: 38.54,38.1 XBEE(SERIAL).1 38.52,38.1 36.51,38.1 36.12,37.7 C6.1 | 63.5,36.83 70.48,36.83 | 59.22,35.07 61.74,35.07 | 63.5,4.13 61.91,2.54 52.36,2.54 POT(A0).3 | S2.2 S1.2 80.64,92.08 RFID(SPI).1 | TEMP(0X48/49).8 19.41,77.87 18.34,77.87 18.1,78.11 | HALL(A2).1 7.16,84.92 6.03,86.04 6.03,87.31 11.11,92.39 | ESP8266.6 42.23,93.03 40.96,94.3 40.96,97.79 | ESP8266.2 46.04,93.98 46.04,97.79 | U$4.11 48.04,81.28 | 48.04,81.28 48.04,83.44 v48.58,83.98 | U$4.6 45.54,80.85 45.97,81.28 46.99,81.28 | 46.99,81.28 48.04,81.28 | U$4.9 47.04,81.23 46.99,81.28
  Top 0.305: U$5.3V 71.75,35.56 70.48,36.83 | 38.54,38.1 41.27,38.1 44.45,34.92 v56.2,34.92 59.08,34.92 59.22,35.07 | v55.56,96.52 53.34,96.52 52.07,97.79 46.04,97.79 40.96,97.79 33.02,97.79 31.75,96.52 | v56.2,28.89 57.78,27.3 57.78,18.41 58.74,17.46 59.69,17.46 60.96,16.19 60.96,14.29 62.87,12.38 62.87,10.16 63.82,9.21 63.82,4.45 63.5,4.13 | 61.74,35.07 63.5,36.83 | 31.75,96.52 31.75,86.68 29.21,84.14 20.64,84.14 19.05,85.72 RTC(A1).1 18.73,85.72 18.1,85.09 18.1,79.74 R1.2 18.1,79.64 18.1,78.11 18.1,77.08 C7.1 17.39,76.52 15.88,76.52 15.88,73.03 22.86,66.04 28.89,66.04 30.16,64.77 30.16,62.23 31.43,60.96 v39.05,60.96 | 11.11,92.39 13.02,92.39 17.46,96.84 27.43,96.84 | 27.43,96.84 31.43,96.84 31.75,96.52 | BLUETOOTH.5 27.43,96.84
  Bottom 0.152: v48.58,83.98 48.58,87 47.31,88.27 ESP8266.2
  Bottom 0.305: v55.56,96.52 76.2,96.52 RFID(SPI).1 | v56.2,28.89 v56.2,34.92 | XBEE(SERIAL).1 39.99,38.09 40.64,38.73 40.64,59.37 v39.05,60.96
+5V  (via drill 0.38, 0.6)
  Top 0.152: C11.1 65.41,6.03 | 66.67,9.65 U2.P$12 | C4.1 14.68,64.69 v14.61,64.77 | v11.27,64.77 11.27,62.71 10.16,61.59 | C5.1 22.07,44.61 22.23,44.77
  Top 0.305: DIO5.2 DIO4.2 | DIO4.2 DIO3.2 DIO2.2 | SPI-1.2 v71.44,40.64 | FUNK(D9).2 96.2,62.23 97.79,63.82 97.79,69.85 IR(A5).2 | U2.P$12 66.8,11.3 65.09,13.02 63.82,13.02 62.55,14.29 v62.55,27.62 | DIO4.2 36.83,52.07 43.18,52.07 SERIAL.2 | v66.67,65.72 73.98,65.72 76.2,67.94 81.28,67.94 81.92,68.58 81.92,73.39 J5.3 | 65.41,6.03 66.67,7.3 66.67,9.65 | C1.1 70.17,25.72 v70.48,26.04 | DIO7.2 33.97,44.13 28.57,44.13 27.94,43.5 22.23,43.5 22.23,44.77 22.23,45.72 21.59,46.35 v20.48,46.35 | IC1.10 10.16,41.96 10.16,43.66 11.91,45.4 v13.18,46.35
  Top 0.406: 1.27,41.91 1.91,41.91 1.91,48.26 STEPPER2.1 | 10.21,61.54 10.16,61.59 | 1.91,61.59 1.27,61.59
  Top 0.61: IC1.10 1.91,41.91 | IC2.10 10.21,61.54 | 10.16,61.59 1.91,61.59
  Top 1.422: 7.3,26.67 STEPPER1.1 | 1.59,40.64 1.27,40.96
  Bottom 0.152: v71.44,40.64 71.44,40.32 | SPI-2.2 64.77,40.96 | v62.55,27.62 62.87,27.62 | 70.17,25.72 v70.48,26.04 | v14.61,64.77 v11.27,64.77
  Bottom 0.305: IR(A5).2 92.71,72.39 91.71,73.39 J4.3 J5.3 | SPI-1.2 SPI-2.2 | 72.07,38.1 72.07,40.01 v71.44,40.64 | 72.07,38.1 72.07,26.99 71.12,26.04 v70.48,26.04 | 64.77,40.96 62.23,43.5 62.23,48.58 | 62.23,48.58 A0.2 A1.2 A2.2 A3.2 A4.2 A5.2 62.23,64.45 63.5,65.72 v66.67,65.72 | 62.23,48.58 58.42,48.58 53.66,53.34 I2C-2.2 I2C-1.2 SERIAL.2 | U$5.5V 72.07,38.1 | 62.87,27.62 64.77,25.72 70.17,25.72 | DIO5.2 DIO6.2 DIO7.2 | v20.48,46.35 v13.18,46.35
  pour Top (no thermals): 9.84,26.99 10.48,26.99 12.06,25.4 13.97,25.4 14.61,26.04 14.61,26.35 15.88,26.35 15.88,23.81 14.61,23.81 14.61,24.13 13.97,24.77 12.06,24.77 11.43,24.13 11.43,22.54 15.56,18.41 15.56,16.83 14.29,16.83 14.29,18.41 9.84,22.86
  pour Top (rank 2, no thermals): 0.64,27.94 9.53,27.94 10.79,26.67 10.79,24.45 9.84,24.45 9.21,25.08 0.64,25.08
  pour Top (rank 2, no thermals): 0,61.91 0,25.08 2.54,25.08 2.54,61.91
+12V  (via drill 0.6)
  Top 0.152: IC4.1 11.8,17.09 11.8,14.98 | PWR_LED.A 18.32,6.89 17.78,6.35 17.78,5.08 | C9.1 19.32,2.22 18.1,2.22 17.78,2.54 17.78,5.08 | 17.78,5.08 15.56,5.08 15.56,2.54 v15.24,2.22
  Top 0.406: C8.1 71.25,25.4 70.61,24.77 U2.P$6
  other vias: 67.94,3.17 68.9,3.17 69.85,3.17 70.48,16.51 71.44,15.56 72.39,14.61 15.24,0.95
  pour Bottom (no thermals): 14.61,3.17 14.61,0 99.06,0 99.06,48.9 96.2,51.75 94.93,51.75 94.93,50.16 95.57,50.16 96.84,48.9 96.84,2.86 96.2,2.22 71.75,2.22 70.48,3.49 67.31,3.49 66.04,2.22 63.18,2.22 62.87,1.91 16.83,1.91 15.88,3.17
  pour Bottom (no thermals): 67.31,2.86 67.31,14.29 70.17,17.14 71.12,17.14 73.03,15.24 73.03,13.97 73.03,3.81 74.61,2.22 74.61,0.95 69.22,0.95
  pour Top (no thermals): 69.85,24.13 69.85,15.88 71.75,13.97 73.03,13.97 73.03,17.78 71.12,19.68 71.12,24.13
  pour Top (no thermals): 72.71,17.78 86.36,17.78 86.68,17.46 86.68,13.02 86.36,12.7 80.64,12.7 79.69,13.65 72.07,13.65 71.44,14.29 71.44,16.51
  pour Top (no thermals): 67.31,5.4 70.48,5.4 70.48,2.86 70.17,2.54 67.63,2.54 67.31,2.86
  pour Top (no thermals): 11.11,17.46 11.11,16.83 12.06,17.46
  pour Top: 0.95,6.67 0.95,3.49 3.49,3.49 3.49,0 16.19,0 16.19,13.65 15.56,13.65 13.02,16.19 13.02,18.41 10.48,18.41 10.48,14.29 11.11,14.29 12.06,13.34 14.61,13.34 14.92,13.02 14.92,3.17 14.61,2.86 7.62,2.86 4.13,6.67
/RST  (via drill 0.38)
  Top 0.152: RESET.B RESET.B' 93.34,11.11 94.93,12.7 95.89,12.7 96.84,13.65 96.84,27.94 v95.25,29.53
  Bottom 0.152: v95.25,29.53 79.06,29.53 75.56,33.02 U$5.RESET
A0  (via drill 0.38)
  Top 0.152: BUT1(A0).B' BUT1(A0).B 41.18,9.75 44.45,13.02 54.29,13.02 | U$5.A0 67.31,50.8 65.79,49.28 61.21,49.28 A0.3 57.15,50.8 54.29,47.94 v54.29,42.55 | v54.29,29.84 54.29,13.02 | 54.29,13.02 56.83,13.02 57.84,14.02 S6.2
  Bottom 0.152: v54.29,29.84 v54.29,42.55
A1  (via drill 0.38)
  Top 0.152: U$5.A1 72.39,52.07 60.96,52.07 A1.3 58.42,53.34 53.02,47.94 v53.02,43.81 | BUT2(A1).B' BUT2(A1).B 34.07,11.84 34.29,12.06 42.23,12.06 44.13,13.97 51.75,13.97 53.02,15.24 v53.02,28.57 | v56.9,56.52 56.9,59.63 56.2,60.33 48.26,60.33 47.62,60.96 42.86,60.96 40.32,63.5 32.07,63.5 31.75,63.82 31.75,66.36 29.84,68.26 S5.1
  Bottom 0.152: v53.02,28.57 v53.02,43.81 | A1.3 57.66,55.37 57.34,55.37 56.83,55.88 56.83,56.45 v56.9,56.52
A2  (via drill 0.3, 0.38)
  Top 0.152: U$5.A2 72.39,54.61 60.96,54.61 A2.3 | v40.01,14.92 50.8,14.92 51.75,15.88 v51.75,29.84 | v51.75,42.55 51.75,47.94 A2.3 | v28.57,12.06 27.3,10.79 27.3,9.85 BUT3(A2).B BUT3(A2).B' | A2.3 57.78,57.78 57.78,60.01 56.83,60.96 48.9,60.96 48.26,61.59 43.18,61.59 40.64,64.14 32.54,64.14 32.23,64.45 32.23,66.52 32.07,66.67 v32.07,71.12 | 32.38,71.75 32.38,71.44 v32.07,71.12 | 32.38,71.75 32.38,83.5 29.53,83.5 28.26,82.23 v19.37,82.23 | v14.61,80.64 13.92,80.64 S4.1 | SJ4.1 40.48,69.38 v38.73,71.12 | v32.07,71.12 32.07,71.44 32.38,71.75
  Bottom 0.152: v51.75,29.84 v51.75,42.55 | v40.01,14.92 39.69,15.24 32.07,15.24 31.75,14.92 31.75,12.38 31.43,12.06 v28.57,12.06 | v19.37,82.23 16.19,82.23 v14.61,80.64 | v38.73,71.12 v32.07,71.12
A3
  Top 0.152: U$5.A3 72.39,57.15 60.96,57.15 A3.3 58.42,59.69 58.42,60.33 57.15,61.59 49.21,61.59 48.58,62.23 43.5,62.23 40.96,64.77 34.61,64.77 34.48,64.9 SJ3.1 | U$5.A3 74.42,58.42 | J4.1 88.27,67.31 86.04,65.09 79.06,65.09 75.25,61.28 75.25,60.01 U$5.A3
A4  (via drill 0.38, 0.38 pad 0.3)
  Top 0.152: U$5.A4 72.39,59.69 60.96,59.69 A4.3 59.37,60.96 57.78,62.55 v53.34,62.55 | v53.34,65.09 53.34,66.72 SJ2.1
  Bottom 0.152: v53.34,62.55 v53.34,65.09
A5  (via drill 0.38)
  Top 0.152: SJ1.1 47.31,66.72 47.31,65.41 49.21,63.5 A5.3 60.96,62.23 72.39,62.23 U$5.A5 76.83,66.67 v80.33,66.67 84.58,66.67 85.34,67.44 85.34,69.85 86.88,71.39 J4.2
  Bottom 0.152: v80.33,66.67 90.17,66.67 93.34,69.85 IR(A5).3
D0  (via drill 0.6)
  Top 0.152: v43.5,69.06 43.5,67.03 SJ4.3
  Bottom 0.152: U$5.D0 25.4,66.36 28.73,69.69 42.86,69.69 v43.5,69.06
D1  (via drill 0.38)
  Top 0.152: v39.05,65.56 38.96,65.56 SJ3.3
  Bottom 0.152: U$5.D1 26.67,62.23 26.67,64.93 26.99,65.25 38.73,65.25 v39.05,65.56
D2  (via drill 0.38)
  Top 0.152: v17.02,58.42 15.24,56.64 15.24,52.7 16.19,51.75 16.19,33.97 17.14,33.02 IC1.2 IC1.1 20.95,31.06 v20.95,27.94 | U2.P$7 69.34,18.86 v69.22,18.73
  Bottom 0.152: v17.02,58.42 U$5.D2 26.67,57.15 31.75,57.15 DIO2.3 | v69.22,18.73 65.72,18.73 64.14,17.14 23.5,17.14 20.95,19.68 v20.95,27.94
D3  (via drill 0.38)
  Top 0.152: U2.P$8 68.07,17.59 v67.94,17.46 | IC1.4 IC1.3 v17.78,34.29 17.46,34.29 16.83,34.92 16.83,55.56 v17.14,55.88
  Bottom 0.152: DIO3.3 31.75,54.61 26.67,54.61 U$5.D3 v17.14,55.88 | v67.94,17.46 65.72,17.46 64.77,16.51 23.18,16.51 20.32,19.37 20.32,28.57 17.78,31.11 v17.78,34.29
D4  (via drill 0.38, 0.41)
  Top 0.152: 17.78,36.58 v17.78,36.83 | v17.78,36.83 v17.78,53.34 | U2.P$9 66.8,16.32 v66.67,16.19 | IC1.6 IC1.5 v17.78,36.83
  Bottom 0.152: DIO4.3 31.75,52.07 26.67,52.07 U$5.D4 v17.78,53.34 | v66.67,16.19 66.36,16.19 66.04,15.88 22.86,15.88 19.68,19.05 19.68,28.26 16.83,31.11 16.83,35.88 v17.78,36.83
D5  (via drill 0.38)
  Top 0.152: DIO5.3 34.29,49.53 40.39,49.53 43.43,46.48 v44.45,46.48 | v55.88,46.48 60.96,46.48 62.99,48.51 v71.12,48.51 74.55,48.51 75.88,49.85 v75.88,59.37 | 81.97,59.44 T1.1 | v71.12,28.26 70.17,28.26 69.85,27.94 65.72,27.94 63.82,26.04 63.82,14.61 64.14,14.29 66.04,14.29 69.34,10.99 U2.P$14 | 81.68,59.15 T1.1 | v79.92,59.47 T1.1 | v22.86,40.64 IC1.8 IC1.7
  Bottom 0.152: DIO5.3 31.75,49.53 26.67,49.53 U$5.D5 24.89,50.8 23.88,49.78 23.88,42.93 22.86,41.91 v22.86,40.64 | v44.45,46.48 v55.88,46.48 | v75.88,59.37 79.82,59.37 v79.92,59.47 | v71.12,48.51 71.12,46.35 70.48,45.72 70.48,33.97 71.12,33.34 v71.12,28.26
D6  (via drill 0.38)
  Top 0.152: DIO6.3 34.29,46.99 41.66,46.99 43.43,45.21 v44.45,45.21 | v55.88,45.21 60.96,45.21 63.18,47.31 v69.85,47.31 71.75,47.31 72.39,47.94 75.56,47.94 v76.2,48.58 | v69.85,29.21 69.22,28.57 65.41,28.57 63.18,26.35 63.18,14.61 64.14,13.65 65.72,13.65 68.07,11.3 U2.P$13 | 81.9,49.21 T4.1 81.97,49.28 81.28,49.28 81.22,49.21 80.33,49.21 v79.69,48.58
  Bottom 0.152: U$5.D6 26.67,46.99 31.75,46.99 DIO6.3 | v44.45,45.21 v55.88,45.21 | v69.85,29.21 v69.85,47.31 | v76.2,48.58 v79.69,48.58
D7  (via drill 0.38)
  Top 0.152: v14.41,47.62 14.41,51.94 13.02,53.34 13.02,69.16 S7.1 | 81.28,39.37 81.76,39.37 T2.1 80.1,39.14 80.01,39.05 | 36.58,41.66 v36.51,41.59 36.83,41.27 59.05,41.27 64.14,46.35 72.07,46.35 72.71,46.99 v76.2,46.99 | 80.01,39.05 80.01,41.27 79.69,41.59 v79.69,46.99 | 80.01,39.05 80.01,30.48 79.38,29.84 77.47,29.84 74.3,26.67 72.07,26.67 71.44,27.3 66.04,27.3 64.45,25.72 64.45,15.24 64.77,14.92 66.36,14.92 70.61,10.67 U2.P$15 | U$5.D7 23.65,45.72 v21.75,47.62
  Bottom 0.152: U$5.D7 27.18,43.94 31.24,43.94 DIO7.3 33.02,44.45 35.88,41.59 v36.51,41.59 | v21.75,47.62 v14.41,47.62 | v76.2,46.99 v79.69,46.99
D8  (via drill 0.3)
  Top 0.152: RFID(SPI).2 78.11,95.89 82.23,95.89 92.08,86.04 92.08,66.67 89.53,64.14 80.01,64.14 77.47,61.59 77.47,41.91 60.96,41.91 59.69,40.64 35.56,40.64 34.29,41.91 32.38,41.91 30.48,40.01 27.3,40.01 25.65,41.66 U$5.D8 v22.86,39.12 | BLUETOOTH.1 17.27,90.68 16,89.41 16,77.98 14.99,76.96 14.99,67.56 13.46,66.04 13.46,53.85 15.49,51.82 15.49,39.88 v14.73,39.12
  Bottom 0.152: v14.73,39.12 v22.86,39.12
D9  (via drill 0.38)
  Top 0.152: SPI-2.3 62.23,38.1 60.96,39.37 36.83,39.37 36.58,39.12 U$5.D9 22.23,35.94 22.23,27.94 21.27,26.99 19.37,26.99 18.41,27.94 13.65,27.94 12.7,26.99 SERVO2(D9).3 | v49.53,81.28 49.53,79.51 U$4.14
  Bottom 0.152: SPI-2.3 66.04,36.83 68.58,36.83 69.22,37.47 69.22,46.35 68.58,46.99 68.58,48.9 69.53,49.85 70.48,49.85 | 70.48,49.85 72.07,49.85 72.71,49.21 74.3,49.21 75.25,50.16 75.25,52.39 76.83,53.98 92.71,53.98 95.25,56.52 FUNK(D9).3 | 70.48,49.85 70.48,69.85 67.31,73.03 50.16,73.03 49.53,73.66 v49.53,81.28
D10  (via drill 0.3, 0.38)
  Top 0.152: v33.34,40.96 34.29,40.96 35.24,40.01 61.59,40.01 62.23,39.37 66.04,39.37 SPI-1.3 68.58,39.37 74.93,39.37 75.88,40.32 v76.2,40.32 | SERVO1(D10).3 14.92,21.59 18.1,21.59 19.68,23.18 19.68,24.77 22.86,27.94 22.86,34.04 U$5.D10 25.46,36.51 v33.34,36.51 33.34,34.29 34.92,32.7 R16.2 | v79.38,40.32 78.74,40.96 78.74,60.33 81.28,62.87 90.81,62.87 93.34,65.41 93.34,87.31 83.5,97.16 64.14,97.16 RFID(SPI).8 50.8,93.98 49.78,92.96 49.78,91.19 47.5,88.9 v44.96,88.9 | v33.02,93.98 34.54,93.98 35.56,95 36.83,95 37.59,94.23 37.59,91.69 38.35,90.93 43.69,90.93 44.96,92.2 44.96,92.52 ESP8266.4
  Bottom 0.152: v79.38,40.32 v76.2,40.32 | v33.34,40.96 v33.34,36.51 | v33.02,93.98 BLUETOOTH.6 | v44.96,88.9 44.96,92.52 ESP8266.4
D11  (via drill 0.3, 0.38)
  Top 0.152: U$5.D11 31.37,34.04 v33.02,32.38 R17.2 | SPI-1.4 SPI-2.4 62.28,33.07 59.67,33.07 59.09,33.66 41.27,33.66 40.69,33.07 40.23,33.07 40.04,33.08 36.57,33.08 v35.88,32.38 | v78.11,34.29 78.11,60.96 80.64,63.5 90.17,63.5 92.71,66.04 92.71,86.68 82.87,96.52 68.58,96.52 RFID(SPI).6 | SPI-1.4 67.94,35.56 | SPI-1.4 70.48,35.56 71.75,34.29 v75.88,34.29
  Bottom 0.152: v78.11,34.29 v75.88,34.29 | v35.88,32.38 v33.02,32.38
D12  (via drill 0.38)
  Top 0.152: 30.48,30.48 29.21,31.75 25.65,31.75 U$5.D12 | 30.48,30.48 v31.75,30.48 | v41.66,30.99 42.42,30.99 43.18,31.75 58.77,31.75 59.42,31.1 62.85,31.1 SPI-2.5 SPI-1.5 70.48,33.02 71.75,31.75 74.93,31.75 77.15,33.97 77.15,38.42 77.79,39.05 77.79,61.28 80.33,63.82 89.85,63.82 92.39,66.36 92.39,86.36 82.55,96.2 70.8,96.2 RFID(SPI).5 | 30.48,30.48 R18.2
  Bottom 0.152: v31.75,30.48 36.42,30.48 37.01,31.07 41.57,31.07 v41.66,30.99
D13  (via drill 0.38)
  Top 0.152: U$5.D13 25.65,29.21 v29.21,29.21 29.21,24.13 28.57,23.5 R19.2 | v41.91,29.21 43.81,31.11 57.23,31.11 59.28,29.07 63.36,29.07 SPI-2.6 SPI-1.6 68.26,30.48 68.9,31.11 70.48,31.11 72.39,29.21 75.25,29.21 79.38,33.34 79.38,37.78 78.42,38.73 78.42,60.64 80.96,63.18 90.49,63.18 93.03,65.72 93.03,87 83.19,96.84 66.36,96.84 RFID(SPI).7
  Bottom 0.152: v29.21,29.21 37.32,29.21 37.5,29.03 41.73,29.03 v41.91,29.21
GND  (via drill 0.3, 0.38, 0.6)
  Top 0.152: 81.92,3.05 D8.A 81.84,2.86 | SPI-1.1 SPI-2.1 | TEMP(0X48/49).6 TEMP(0X48/49).5 21.61,75.25 | RESET.A' 95.98,6.31 | 95.98,6.31 RESET.A | 95.98,6.31 94.34,6.31 v94.3,6.35 | 38.42,19.98 XBEE(SERIAL).10 | C11.2 65.41,3.49 | 73.03,4.52 C3.- 72.31,6.03 66.99,6.03 66.67,5.71 66.67,4.76 65.67,3.76 C11.2 | U2.P$11 65.53,8.06 v65.41,7.94 | C11.2 65.41,3.81 | LED3.C LED4.C 26.6,13.22 | LED3.C LED2.C LED1.C | 35.04,13.34 LED1.C | SERVO1(D10).1 SERVO2(D9).1 | 4.76,19.64 IC4.3 | C6.2 35.56,34.92 v35.88,34.61 | 26.6,13.22 R5.1 26.08,10.84 25.4,10.16 23.81,10.16 BUT3(A2).A 23.4,6.37 | LED3.C 30.48,10.16 BUT2(A1).A BUT2(A1).A' | 26.6,13.22 26.55,13.22 26.04,12.7 26.04,13.97 25.08,14.92 22.86,14.92 22.23,15.56 22.23,17.02 22.1,17.14 | 23.4,6.37 BUT3(A2).A' 23.4,4.35 23.5,4.45 19.64,4.45 C9.2 | 23.4,6.37 24.75,6.37 v24.77,6.35 | R22.1 35.08,13.06 LED1.C | 21.61,75.25 TEMP(0X48/49).4 | C7.2 19.13,74.69 19.68,75.25 21.61,75.25 | HALL(A2).3 10.13,87.03 v10.16,87 | SPK.+ 6.46,71.23 v6.35,71.12 | C2.2 7.3,21.91 5.4,20 5.12,20 IC4.3 | IC4.3 4.49,19.33 7.94,15.88 v7.94,13.65 | CN1.GNDBREAK 11.9,11.28 v11.75,11.43 11.75,8.26 13.44,6.57 CN1.GND | C4.2 18.26,63.34 v20.32,61.28 | R9.1 25.57,91.02 24.89,91.69 BLUETOOTH.4 | U$4.29 57.04,77.87 56.9,77.72 | 56.9,77.72 55.12,77.72 | 55.12,77.72 55.12,79.43 U$4.25 | C19.2 67.53,80.22 | 67.53,80.22 67.82,80.52 67.82,84.07 | 67.82,84.07 66.08,84.07 C12.2 | R4.1 67.53,86.14 | 67.53,86.14 67.56,86.11 67.56,84.33 67.82,84.07 | RFID(SPI).3 73.66,91.69 72.64,90.68 68.58,90.68 67.56,89.66 67.56,86.18 67.53,86.14 | U$4.24 54.54,77.79 | 54.54,77.79 54.61,77.72 55.12,77.72 | U$4.23 54.04,77.78 | 54.04,77.78 54.1,77.72 54.47,77.72 54.54,77.79
  Top 0.152: U$4.22 53.54,77.78 | 53.54,77.78 53.59,77.72 53.98,77.72 54.04,77.78 | 53.04,77.77 U$4.21 53.09,79.55 53.09,80.52 52.58,81.03 51.31,81.03 51.04,80.76 U$4.17 51.04,77.74 51.05,77.72 50.55,77.72 | 53.04,77.77 53.09,77.72 53.49,77.72 53.54,77.78 | 53,77.72 53.04,77.77 | U$4.16 50.54,77.73 50.55,77.72 | U$4.15 50.04,77.73 50.04,77.72 | 50.04,77.72 50.55,77.72 | U$4.13 49.04,77.74 49.02,77.72 | 49.02,77.72 50.04,77.72 | U$4.12 48.54,77.75 48.51,77.72 | 48.51,77.72 49.02,77.72 | U$4.10 47.54,77.93 | 47.54,77.93 47.75,77.72 48.51,77.72 | U$4.8 46.54,77.92 46.74,77.72 47.33,77.72 47.54,77.93 | 56.9,77.72 56.9,77.22 57.4,76.71 57.4,74.93 57.91,74.42 67.31,74.42 67.82,74.93 67.82,79.93 67.53,80.22
  Top 0.305: v65.41,20.64 65.53,20.77 U2.P$10 65.53,24.89 66.36,25.72 C1.2 | C17.- 22.1,17.14 | TEMP(0X48/49).4 21.61,72.69 23.18,71.12 25.98,71.12 S3.1 | C7.2 v17.46,73.03 | IC2.9 20.27,61.23 v20.32,61.28 | IC1.9 20.27,42.6 20,42.86 | 20,42.86 19.53,43.34 19.53,44.53 C5.2 19.45,44.53 | v20.8,43.18 20.32,43.18 20,42.86
  Bottom 0.152: 79.76,54.86 79.76,54.36 | v94.3,6.35 93.66,6.35 | v65.41,20.64 65.41,20.32 65.72,20 | v65.41,7.94 65.41,7.62 | v7.94,13.65 6.67,12.38 | v35.88,34.61 35.88,33.97 36.2,33.66 | v24.77,6.35 25.4,6.35 | v10.16,87 11.11,87 | v6.35,71.12 6.35,70.48
  Bottom 0.305: v17.46,73.03 17.46,72.71 17.78,72.39 | v20.32,61.28 20.32,61.91 | v20.8,43.18 21.11,43.18 21.59,42.7
  other vias: 81.28,52.7 81.28,42.55 81.28,32.38 75.88,8.26 73.98,6.03 74.61,3.49 79.38,26.67 78.11,23.5 84.14,28.57 4.13,12.06 4.13,11.11 4.13,10.16 11.75,12.38 11.75,10.48
  pour Bottom (rank 2): 0,0 0,83.82 15.24,99.06 83.82,99.06 99.06,83.82 99.06,0.25 98.81,0
  pour Top (rank 2, no thermals): 80.64,55.24 83.82,55.24 84.45,54.61 84.45,51.44 81.28,51.44 80.64,52.07
  pour Top (rank 2, no thermals): 80.64,45.09 83.82,45.09 84.45,44.45 84.45,41.27 81.28,41.27 80.64,41.91
  pour Top (rank 2, no thermals): 80.64,34.92 83.82,34.92 84.45,34.29 84.45,31.11 81.28,31.11 80.64,31.75
  pour Top (rank 6, no thermals): 72.07,4.13 76.2,0 86.68,0 86.68,10.79 72.07,10.79
  pour Top (rank 4, no thermals): 80.64,32.38 80.64,29.84 75.25,24.45 75.25,22.23 86.68,22.23 87.31,22.86 87.31,31.75 86.68,32.38
  pour Top: 13.65,3.49 8.26,3.49 3.81,7.94 3.81,17.14 4.13,17.46 8.89,17.46 9.84,16.51 9.84,13.97 10.48,13.34 11.11,13.34 11.75,12.7 13.34,12.7 13.97,12.06 13.97,3.81
N$1
  Top 0.152: S1.1 78.96,81.23 R20.2
N$2
  Top 0.152: U$4.5 45.04,82.13 49.28,86.36 53.85,86.36 56.64,89.15 56.64,91.67 C18.2
N$3
  Top 0.305: RTC(A1).2 24.29,87.26 R9.2 28.94,89.32 S5.2
N$4
  Top 0.152: S4.2 13.34,86.36 11.43,84.45 9.38,84.45 HALL(A2).2
N$5
  Top 0.152: S2.1 83.72,81.23 R21.2
N$7
  Top 0.152: S6.1 52.35,5.03 POT(A0).2
N$8
  Top 0.152: SPK.- 6.51,78.27 8.26,80.01 11.06,80.01 S7.2
N$9
  Top 0.152: TEMP(0X48/49).7 20.31,79.43 R1.1 25.67,79.69 S3.2
N$10  (via drill 0.3, 0.38)
  Top 0.152: U$5.SCL 26.1,18.8 27.3,20 27.3,21.27 27.62,21.59 27.62,26.04 v27.94,26.35 | v28.57,40.96 30.16,42.55 46.67,42.55 47.31,43.18 47.31,55.24 v47.62,55.56 | v47.62,63.18 47.62,63.82 46.35,65.09 46.35,68.26 46.67,68.58 49.85,68.58 50.48,67.94 50.48,66.95 SJ1.3
  Bottom 0.152: v27.94,26.35 27.94,40.32 v28.57,40.96 | v47.62,55.56 v47.62,63.18
N$11  (via drill 0.38)
  Top 0.152: U$5.SDA 26.42,21.34 26.99,21.91 v26.99,27.62 | v27.62,42.23 28.26,42.23 29.21,43.18 46.35,43.18 46.67,43.5 v46.67,57.15 | v45.72,64.14 45.72,68.9 46.35,69.53 55.24,69.53 56.52,68.26 56.52,66.95 SJ2.3
  Bottom 0.152: v26.99,27.62 26.99,41.59 v27.62,42.23 | v46.67,57.15 46.67,63.18 v45.72,64.14
N$12
  Top 0.178: 40.51,67.06 41.91,67.06
N$13
  Top 0.178: 49.28,66.93 50.42,66.93
N$14
  Top 0.178: 55.12,66.93 56.39,66.93
N$15
  Top 0.152: 65.83,87.63 R4.2 66,87.88 60.45,87.88 55.54,82.97 U$4.26
N$19
  Top 0.152: U$4.28 56.54,80.42 57.4,81.28 60.45,81.28 63.25,78.49 66,78.49 C19.1
N$20
  Top 0.152: R16.1 LED1.A
N$21
  Top 0.152: R17.1 LED2.A
N$22
  Top 0.152: R18.1 LED3.A
N$23
  Top 0.152: R19.1 LED4.A
N$24
  Top 0.61: IC2.12 IC2.11 STEPPER2.5
N$25
  Top 0.61: STEPPER2.4 IC2.13 IC2.14
N$26
  Top 0.61: IC2.16 IC2.15 STEPPER2.3
N$27
  Top 0.61: STEPPER2.2 IC2.17 IC2.18
N$30
  Top 0.152: U$4.27 56.04,80.93 57.4,82.3 66,82.3 C12.1
N$31
  Top 0.152: BUT1(A0).A' BUT1(A0).A 38.05,11.06 R22.2
N$32
  Top 0.152: U$4.4 44.54,82.39 50.55,88.39 53.09,88.39 54.86,90.17 54.86,91.59 C18.1
N$34
  pour Top (rank 2, no thermals): 85.72,52.7 88.27,52.7 88.27,51.44 85.72,51.44
N$35
  pour Top (no thermals): 95.25,48.9 94.93,48.9 93.34,50.48 93.34,55.24 89.53,59.05 81.92,59.05 81.92,55.24 88.9,55.24 89.53,54.61 89.53,50.16 92.08,47.62 95.25,47.62
N$36
  pour Top (rank 2, no thermals): 85.72,42.55 88.27,42.55 88.27,41.27 85.72,41.27
N$37
  Top 0.152: R10.2 89.41,41.91
  pour Top (no thermals): 94.93,46.67 91.76,46.67 89.53,48.9 81.92,48.9 81.92,45.09 88.9,45.09 89.53,44.45 89.53,41.27 90.81,41.27 94.61,45.09 95.25,45.09 95.25,46.35
N$38
  pour Top (rank 2, no thermals): 85.72,32.38 88.27,32.38 88.27,31.11 85.72,31.11
N$39
  pour Top (no thermals): 95.89,40.64 95.89,43.18 95.25,43.81 94.61,43.81 89.53,38.73 81.92,38.73 81.92,34.92 88.9,34.92 89.53,34.29 89.53,31.11 90.81,31.11 93.34,33.66 93.34,38.1
N$41
  Top 0.61: STEPPER1.5 IC1.12 IC1.11
N$42
  Top 0.61: IC1.13 IC1.14 STEPPER1.4
N$43
  Top 0.61: STEPPER1.3 IC1.16 IC1.15
N$44
  Top 0.61: IC1.17 IC1.18 STEPPER1.2
N$47
  Top 0.152: U$4.3 44.04,82.65 51.56,90.17 52.32,90.17 52.58,90.42 52.58,91.73 C10.2
N$48
  Top 0.152: U$4.2 43.54,83.67 50.8,90.93 50.8,91.66 C10.1
OUT1
  pour Top (rank 3, no thermals): 72.71,24.13 72.71,20.64 73.34,20 83.19,20 83.82,20.64 83.82,22.86 84.77,22.23 95.25,22.23 95.25,23.18 92.39,26.04 82.55,26.04 78.74,22.23 73.98,22.23 73.98,24.13
OUT2
  pour Top (rank 2, no thermals): 95.89,20.32 95.25,19.37 87.95,19.37 86.68,18.1 73.03,18.1 71.44,19.68 71.44,24.13 72.39,24.13 72.39,20.95 73.34,20 83.19,20 83.82,20.64 83.82,22.86 84.77,23.81 86.68,23.81 88.58,21.91 94.3,21.91
OUT3
  pour Top (rank 5, no thermals): 95.25,14.29 95.25,16.19 91.12,16.19 85.72,10.79 80.64,10.79 79.06,12.38 74.3,12.38 72.71,10.79 72.71,8.89 73.98,8.89 73.98,10.79 77.47,10.79 77.47,8.89 82.23,4.13 87,4.13 91.76,8.89 92.08,11.11
OUT4
  pour Top (rank 4, no thermals): 71.44,8.89 71.44,12.38 73.66,14.61 82.23,14.61 86.04,12.38 92.39,18.73 95.25,18.73 95.57,18.41 95.57,17.14 95.25,16.83 93.66,16.83 86.68,9.84 86.68,6.35 84.77,6.35 84.77,9.84 83.82,10.79 80.01,10.79 78.74,12.06 73.66,12.06 72.39,10.79 72.39,8.89
PTC0
  Top 0.152: IC2.6 IC2.5 22.23,54.61 24.77,52.07 26.67,52.07 D0-7.6
PTC5
  Top 0.152: IC2.2 IC2.1 22.23,49.53 22.86,48.9 22.86,48.26 24.13,46.99 26.67,46.99 D0-7.8
PTC7
  Top 0.152: IC2.4 IC2.3 22.23,52.07 22.86,51.44 22.86,50.8 24.13,49.53 26.67,49.53 D0-7.7
PTC9
  Top 0.152: IC2.8 IC2.7 22.23,57.15 22.86,56.52 22.86,55.88 24.13,54.61 26.04,54.61 27.3,53.34 D0-7.5
PWR_LED
  Top 0.152: PWR_LED.C 19.37,10.16 21.91,12.7 R5.2
RX  (via drill 0.38)  (5 unrouted)
  Top 0.152: v43.81,64.77 42.86,64.77 41.91,65.72 41.91,66.91 SJ4.2 42,71.03 41.27,71.75 39.69,71.75 36.13,75.31 v36.13,93.6
  Bottom 0.152: XBEE(SERIAL).2 40.53,36.09 41.59,37.15 41.59,55.56 SERIAL.4 44.45,64.14 v43.81,64.77 | BLUETOOTH.3 23.94,95.57 34.04,95.57 36.13,93.47 v36.13,93.6 36.26,93.73
  Bottom 0.178: 36.26,93.73 37.27,92.71 ESP8266.8
SCL  (via drill 0.38, 0.41, 0.6)
  Top 0.152: 50.8,58.42 I2C-1.4 47.62,58.42 47.31,58.74 47.31,59.37 46.23,60.45 42.42,60.45 40.01,62.87 31.75,62.87 31.27,63.34 31.27,65.88 29.53,67.63 23.5,67.63 20.31,70.81 TEMP(0X48/49).2 | 50.8,58.42 I2C-2.4 53.4,58.42 v54.36,59.37 | J5.1 79.83,69.22 76.2,69.22 73.66,66.67 62.87,66.67 60.96,64.77 57.15,64.77 56.52,64.14 v54.29,64.14 50.8,64.14 | R21.1 v83.19,70.8 | XBEE(SERIAL).19 51.22,36.09 v50.48,36.83 | v50.48,43.5 50.48,48.9 50.8,49.21 50.8,58.42 | 50.8,64.14 50.16,64.14 48.9,65.41 48.9,66.78 SJ1.2 | U$4.18 51.54,71.86 v50.55,70.87 | v50.55,64.77 50.55,64.39 50.8,64.14
  Bottom 0.152: v50.48,36.83 v50.48,43.5 | v83.19,70.8 83.19,70.17 82.23,69.22 80.19,69.22 J5.1 | v54.36,59.37 54.36,60.64 | 54.36,60.64 54.36,60.71 | v54.29,64.14 54.29,60.71 54.36,60.64 | v50.55,70.87 v50.55,64.77
SDA  (via drill 0.38)
  Top 0.152: 77.47,71.75 73.03,67.31 62.87,67.31 60.64,65.09 58.42,65.09 | 77.47,71.75 79.64,71.75 J5.2 | R20.1 78.74,77.47 77.47,76.2 77.47,71.75 | TEMP(0X48/49).1 19.66,70.51 23.18,66.99 29.21,66.99 30.8,65.41 30.8,62.87 31.43,62.23 39.69,62.23 41.97,59.94 45.97,59.94 46.67,59.24 46.67,58.42 47.62,57.47 48.26,57.47 49.53,56.2 I2C-1.3 47.94,54.29 47.94,48.26 48.9,47.31 v48.9,43.5 | I2C-2.3 54.36,55.88 v55.31,56.83 | XBEE(SERIAL).20 48.91,38.09 v48.9,38.1 | SJ2.2 55.24,66.69 v55.24,65.09 58.42,65.09 | U$4.19 52.04,77.75 52.07,77.72 52.58,77.72 52.58,79.47 U$4.20 52.54,73.95 58.42,68.07 58.42,65.09
  Bottom 0.152: I2C-1.3 I2C-2.3 | v48.9,38.1 v48.9,43.5 | v55.31,56.83 55.31,65.02 v55.24,65.09
TX  (via drill 0.3, 0.38)
  Top 0.152: SERIAL.3 v41.91,58.42 | v38.42,68.9 36.51,68.9 | 36.51,68.9 35.88,68.26 35.88,67.12 SJ3.2 | 36.51,68.9 36.51,72.39 34.61,74.3 34.61,91.12 v34.54,91.19
  Top 0.178: 34,67 SJ3.2
  Bottom 0.152: XBEE(SERIAL).3 40.12,34.09 42.55,36.51 42.55,53.98 SERIAL.3 | v41.91,58.42 41.91,65.41 v38.42,68.9 | BLUETOOTH.2 21.72,92.08 34.8,92.08 34.54,91.82 v34.54,91.19
  Bottom 0.178: 34.8,92.08 35.69,91.19 43.18,91.19 43.43,91.44 43.43,93.34 44.07,93.98 46.04,93.98 ESP8266.1

### Text on the board
tPlace: C:/Users/tagauden/Desktop/IOT_KIt/IOTKit_V2/EP.bmp | +
tNames: OLED I2C (0x87) | ON | ON | ON | ON | I2C TERM | G | ON | 1 | ADDR | 0 | Made in Switzerland | github.com/mc-b/IoTKit | BUZZER(D7) | G | I2C | A3/A5 | SERIAL | I2C | GROOVE | D2 | RX | SCL | D3 | TX | SDA | D4 | V | V | D5 | G | G | + | + | D6 | S | V | G | SPI | D7 | 2 | 1 | S | V | G | G | G | V | V | D9 | D10 | MO | MO | MI | MI | SCK | SCK | + | (D13) | (D12) | (D11) | (D10) | Max 12VDC | ON
bNames: IoTKit V2.0, 2015 | https://github.com/mc-b/IoTKit
tValues: L298P013TR